# EAGLE design Sequencer-Logic-Prod-V2.1 copy (EAGLE 9.6.2)

## Sheet 1 of 9: uCode PC Counter
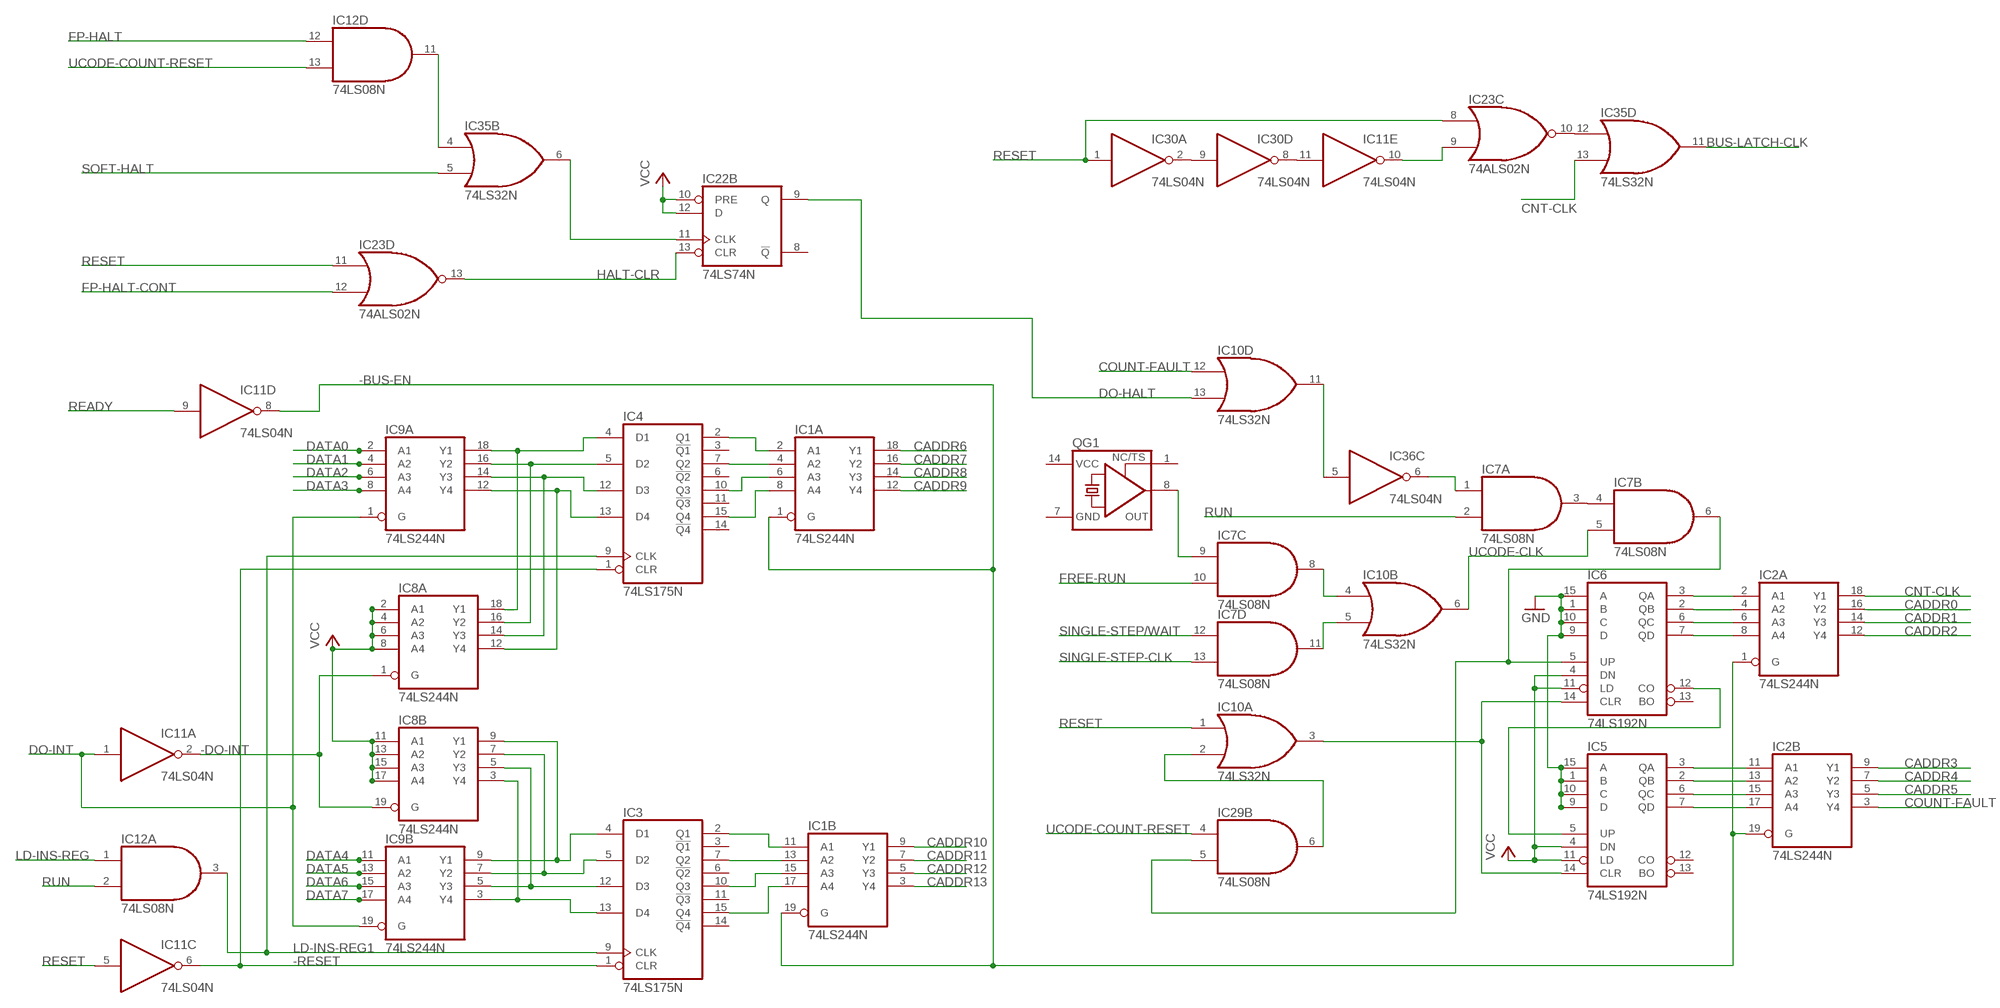
[diagram p0: schematic, sheet 1]

### Parts
IC1  74LS244N  [DIL20]
IC2  74LS244N  [DIL20]
IC3  74LS175N  [DIL16]
IC4  74LS175N  [DIL16]
IC5  74LS192N  [DIL16]
IC6  74LS192N  [DIL16]
IC7  74LS08N  [DIL14]
IC8  74LS244N  [DIL20]
IC9  74LS244N  [DIL20]
IC10  74LS32N  [DIL14]
IC11  74LS04N  [DIL14]
IC12  74LS08N  [DIL14]
IC22  74LS74N  [DIL14]
IC23  74ALS02N  [DIL14]
IC29  74LS08N  [DIL14]
IC30  74LS04N  [DIL14]
IC35  74LS32N  [DIL14]
IC36  74LS04N  [DIL14]
QG1  XO-14  [DIL14S]

### Nets
-BUS-EN: IC1.1(A:G) IC1.19(B:G) IC2.1(A:G) IC2.19(B:G) IC11.8(D:O) ; also sheet 2,8
-DO-INT: IC8.1(A:G) IC8.19(B:G) IC11.2(A:O)
-RESET: IC3.1(CLR) IC4.1(CLR) IC11.6(C:O) ; also sheet 8
BUS-LATCH-CLK: IC35.11(D:O) ; also sheet 2
CADDR0: IC2.16(A:Y2) ; also sheet 9
CADDR1: IC2.14(A:Y3) ; also sheet 9
CADDR2: IC2.12(A:Y4) ; also sheet 9
CADDR3: IC2.9(B:Y1) ; also sheet 9
CADDR4: IC2.7(B:Y2) ; also sheet 9
CADDR5: IC2.5(B:Y3) ; also sheet 9
CADDR6: IC1.18(A:Y1) ; also sheet 9
CADDR7: IC1.16(A:Y2) ; also sheet 9
CADDR8: IC1.14(A:Y3) ; also sheet 9
CADDR9: IC1.12(A:Y4) ; also sheet 9
CADDR10: IC1.9(B:Y1) ; also sheet 9
CADDR11: IC1.7(B:Y2) ; also sheet 9
CADDR12: IC1.5(B:Y3) ; also sheet 9
CADDR13: IC1.3(B:Y4) ; also sheet 9
CNT-CLK: IC2.18(A:Y1) IC35.13(D:I1)
COUNT-FAULT: IC2.3(B:Y4) IC10.12(D:I0)
COUNT-RESET: IC5.14(CLR) IC6.14(CLR) IC10.3(A:O)
DATA0: IC9.2(A:A1) ; also sheet 4,6,8
DATA1: IC9.4(A:A2) ; also sheet 4,6,8
DATA2: IC9.6(A:A3) ; also sheet 4,6,8
DATA3: IC9.8(A:A4) ; also sheet 4,6,8
DATA4: IC9.11(B:A1) ; also sheet 4,6,8
DATA5: IC9.13(B:A2) ; also sheet 4,6,8
DATA6: IC9.15(B:A3) ; also sheet 4,6,8
DATA7: IC9.17(B:A4) ; also sheet 4,6,8
DO-HALT: IC10.13(D:I1) IC22.9(B:Q)
DO-INT: IC9.1(A:G) IC9.19(B:G) IC11.1(A:I) ; also sheet 3
FP-HALT: IC12.12(D:I0) ; also sheet 5
FP-HALT-CONT: IC23.12(D:I1) ; also sheet 5
FREE-RUN: IC7.10(C:I1) ; also sheet 5
GND: IC5.1(B) IC5.9(D) IC5.10(C) IC5.15(A) IC6.1(B) IC6.9(D) IC6.10(C) IC6.15(A) ; also sheet 3,5,6,7,8,9
HALT-CLR: IC22.13(B:CLR) IC23.13(D:O)
LD-INS-REG: IC12.1(A:I0) ; also sheet 2
LD-INS-REG1: IC3.9(CLK) IC4.9(CLK) IC12.3(A:O)
N$1: IC5.5(UP) IC6.12(CO)
N$2: IC1.2(A:A1) IC4.2(Q1)
N$3: IC1.4(A:A2) IC4.7(Q2)
N$4: IC6.5(UP) IC7.6(B:O) IC29.5(B:I1)
N$5: IC4.4(D1) IC8.18(A:Y1) IC9.18(A:Y1)
N$6: IC4.5(D2) IC8.16(A:Y2) IC9.16(A:Y2)
N$7: IC2.2(A:A1) IC6.3(QA)
N$8: IC2.4(A:A2) IC6.2(QB)
N$9: IC2.6(A:A3) IC6.6(QC)
N$10: IC1.6(A:A3) IC4.10(Q3)
N$11: IC2.8(A:A4) IC6.7(QD)
N$12: IC2.11(B:A1) IC5.3(QA)
N$13: IC2.13(B:A2) IC5.2(QB)
N$14: IC2.15(B:A3) IC5.6(QC)
N$15: IC2.17(B:A4) IC5.7(QD)
N$16: IC7.1(A:I0) IC36.6(C:O)
N$17: IC4.12(D3) IC8.14(A:Y3) IC9.14(A:Y3)
N$18: IC4.13(D4) IC8.12(A:Y4) IC9.12(A:Y4)
N$19: IC3.4(D1) IC8.9(B:Y1) IC9.9(B:Y1)
N$20: IC3.5(D2) IC8.7(B:Y2) IC9.7(B:Y2)
N$21: IC3.12(D3) IC8.5(B:Y3) IC9.5(B:Y3)
N$22: IC3.13(D4) IC8.3(B:Y4) IC9.3(B:Y4)
N$23: IC1.8(A:A4) IC4.15(Q4)
N$26: IC10.11(D:O) IC36.5(C:I)
N$31: IC7.3(A:O) IC7.4(B:I0)
N$32: IC23.10(C:O) IC35.12(D:I0)
N$33: IC22.11(B:CLK) IC35.6(B:O)
N$34: IC1.11(B:A1) IC3.2(Q1)
N$35: IC1.13(B:A2) IC3.7(Q2)
N$36: IC1.15(B:A3) IC3.10(Q3)
N$37: IC1.17(B:A4) IC3.15(Q4)
N$38: IC7.11(D:O) IC10.5(B:I1)
N$39: IC7.8(C:O) IC10.4(B:I0)
N$40: IC7.9(C:I0) QG1.8(OUT)
N$42: IC11.11(E:I) IC30.8(D:O)
N$44: IC30.2(A:O) IC30.9(D:I)
N$46: IC11.10(E:O) IC23.9(C:I1)
N$54: IC12.11(D:O) IC35.4(B:I0)
N$55: IC10.2(A:I1) IC29.6(B:O)
READY: IC11.9(D:I) ; also sheet 9
RESET: IC10.1(A:I0) IC11.5(C:I) IC23.8(C:I0) IC23.11(D:I0) IC30.1(A:I) ; also sheet 3,5
RUN: IC7.2(A:I1) IC12.2(A:I1) ; also sheet 5
SINGLE-STEP-CLK: IC7.13(D:I1) ; also sheet 5
SINGLE-STEP/WAIT: IC7.12(D:I0) ; also sheet 5
SOFT-HALT: IC35.5(B:I1) ; also sheet 2
UCODE-CLK: IC7.5(B:I1) IC10.6(B:O)
UCODE-COUNT-RESET: IC12.13(D:I1) IC29.4(B:I0) ; also sheet 2
VCC: IC5.4(DN) IC5.11(LD) IC6.4(DN) IC6.11(LD) IC8.2(A:A1) IC8.4(A:A2) IC8.6(A:A3) IC8.8(A:A4) IC8.11(B:A1) IC8.13(B:A2) IC8.15(B:A3) IC8.17(B:A4) IC22.10(B:PRE) IC22.12(B:D) ; also sheet 3,5,7,9
Unconnected: IC3.3(!Q1) IC3.6(!Q2) IC3.11(!Q3) IC3.14(!Q4) IC4.3(!Q1) IC4.6(!Q2) IC4.11(!Q3) IC4.14(!Q4) IC5.12(CO) IC5.13(BO) IC6.13(BO) IC22.8(B:!Q) QG1.1(TS)

## Sheet 2 of 9: Latching
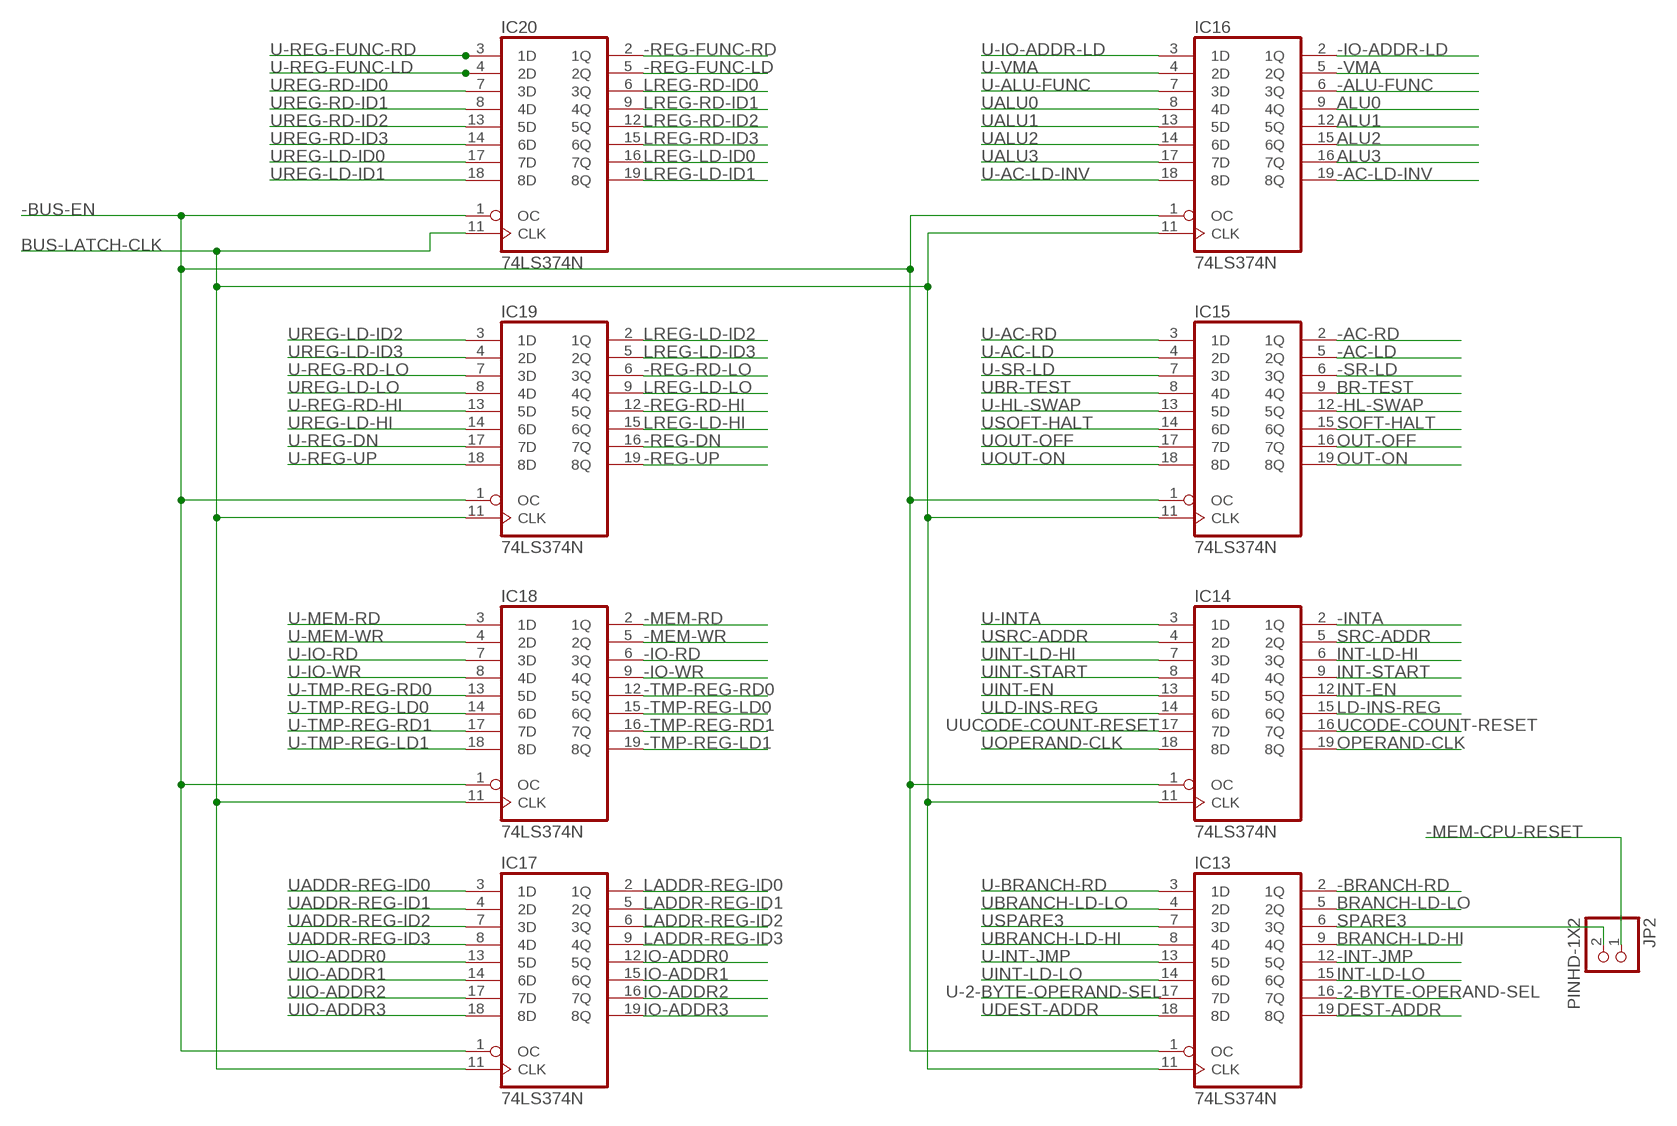
[diagram p1: schematic, sheet 2]

### Parts
IC13  74LS374N  [DIL20]
IC14  74LS374N  [DIL20]
IC15  74LS374N  [DIL20]
IC16  74LS374N  [DIL20]
IC17  74LS374N  [DIL20]
IC18  74LS374N  [DIL20]
IC19  74LS374N  [DIL20]
IC20  74LS374N  [DIL20]
JP2  PINHD-1X2  [1X02]

### Nets
-2-BYTE-OPERAND-SEL: IC13.16(7Q) ; also sheet 6
-AC-LD: IC15.5(2Q) ; also sheet 8
-AC-LD-INV: IC16.19(8Q) ; also sheet 8
-AC-RD: IC15.2(1Q) ; also sheet 8
-ALU-FUNC: IC16.6(3Q) ; also sheet 8
-BRANCH-RD: IC13.2(1Q) ; also sheet 4
-BUS-EN: IC13.1(OC) IC14.1(OC) IC15.1(OC) IC16.1(OC) IC17.1(OC) IC18.1(OC) IC19.1(OC) IC20.1(OC) ; also sheet 1,8
-HL-SWAP: IC15.12(5Q) ; also sheet 8
-INT-JMP: IC13.12(5Q) ; also sheet 4
-INTA: IC14.2(1Q) ; also sheet 8
-IO-ADDR-LD: IC16.2(1Q) ; also sheet 8
-IO-RD: IC18.6(3Q) ; also sheet 8
-IO-WR: IC18.9(4Q) ; also sheet 8
-MEM-CPU-RESET: JP2.1 ; also sheet 9
-MEM-RD: IC18.2(1Q) ; also sheet 8
-MEM-WR: IC18.5(2Q) ; also sheet 8
-REG-DN: IC19.16(7Q) ; also sheet 8
-REG-FUNC-LD: IC20.5(2Q) ; also sheet 8
-REG-FUNC-RD: IC20.2(1Q) ; also sheet 8
-REG-RD-HI: IC19.12(5Q) ; also sheet 8
-REG-RD-LO: IC19.6(3Q) ; also sheet 8
-REG-UP: IC19.19(8Q) ; also sheet 8
-SR-LD: IC15.6(3Q) ; also sheet 8
-TMP-REG-LD0: IC18.15(6Q) ; also sheet 8
-TMP-REG-LD1: IC18.19(8Q) ; also sheet 8
-TMP-REG-RD0: IC18.12(5Q) ; also sheet 8
-TMP-REG-RD1: IC18.16(7Q) ; also sheet 8
-VMA: IC16.5(2Q) ; also sheet 8
ALU0: IC16.9(4Q) ; also sheet 8
ALU1: IC16.12(5Q) ; also sheet 8
ALU2: IC16.15(6Q) ; also sheet 8
ALU3: IC16.16(7Q) ; also sheet 8
BR-TEST: IC15.9(4Q) ; also sheet 4
BRANCH-LD-HI: IC13.9(4Q) ; also sheet 4
BRANCH-LD-LO: IC13.5(2Q) ; also sheet 4
BUS-LATCH-CLK: IC13.11(CLK) IC14.11(CLK) IC15.11(CLK) IC16.11(CLK) IC17.11(CLK) IC18.11(CLK) IC19.11(CLK) IC20.11(CLK) ; also sheet 1
DEST-ADDR: IC13.19(8Q) ; also sheet 6
INT-EN: IC14.12(5Q) ; also sheet 3
INT-LD-HI: IC14.6(3Q) ; also sheet 4
INT-LD-LO: IC13.15(6Q) ; also sheet 4
INT-START: IC14.9(4Q) ; also sheet 3
IO-ADDR0: IC17.12(5Q) ; also sheet 8
IO-ADDR1: IC17.15(6Q) ; also sheet 8
IO-ADDR2: IC17.16(7Q) ; also sheet 8
IO-ADDR3: IC17.19(8Q) ; also sheet 8
LADDR-REG-ID0: IC17.2(1Q) ; also sheet 6
LADDR-REG-ID1: IC17.5(2Q) ; also sheet 6
LADDR-REG-ID2: IC17.6(3Q) ; also sheet 6
LADDR-REG-ID3: IC17.9(4Q) ; also sheet 6
LD-INS-REG: IC14.15(6Q) ; also sheet 1
LREG-LD-HI: IC19.15(6Q) ; also sheet 4
LREG-LD-ID0: IC20.16(7Q) ; also sheet 6
LREG-LD-ID1: IC20.19(8Q) ; also sheet 6
LREG-LD-ID2: IC19.2(1Q) ; also sheet 6
LREG-LD-ID3: IC19.5(2Q) ; also sheet 6
LREG-LD-LO: IC19.9(4Q) ; also sheet 4
LREG-RD-ID0: IC20.6(3Q) ; also sheet 6
LREG-RD-ID1: IC20.9(4Q) ; also sheet 6
LREG-RD-ID2: IC20.12(5Q) ; also sheet 6
LREG-RD-ID3: IC20.15(6Q) ; also sheet 6
OPERAND-CLK: IC14.19(8Q) ; also sheet 6
OUT-OFF: IC15.16(7Q) ; also sheet 3
OUT-ON: IC15.19(8Q) ; also sheet 3
SOFT-HALT: IC15.15(6Q) ; also sheet 1
SPARE3: IC13.6(3Q) JP2.2
SRC-ADDR: IC14.5(2Q) ; also sheet 6
U-2-BYTE-OPERAND-SEL: IC13.17(7D) ; also sheet 9
U-AC-LD: IC15.4(2D) ; also sheet 9
U-AC-LD-INV: IC16.18(8D) ; also sheet 9
U-AC-RD: IC15.3(1D) ; also sheet 9
U-ALU-FUNC: IC16.7(3D) ; also sheet 9
U-BRANCH-RD: IC13.3(1D) ; also sheet 9
U-HL-SWAP: IC15.13(5D) ; also sheet 9
U-INT-JMP: IC13.13(5D) ; also sheet 9
U-INTA: IC14.3(1D) ; also sheet 9
U-IO-ADDR-LD: IC16.3(1D) ; also sheet 9
U-IO-RD: IC18.7(3D) ; also sheet 9
U-IO-WR: IC18.8(4D) ; also sheet 9
U-MEM-RD: IC18.3(1D) ; also sheet 9
U-MEM-WR: IC18.4(2D) ; also sheet 9
U-REG-DN: IC19.17(7D) ; also sheet 9
U-REG-FUNC-LD: IC20.4(2D) ; also sheet 9
U-REG-FUNC-RD: IC20.3(1D) ; also sheet 9
U-REG-RD-HI: IC19.13(5D) ; also sheet 9
U-REG-RD-LO: IC19.7(3D) ; also sheet 9
U-REG-UP: IC19.18(8D) ; also sheet 9
U-SR-LD: IC15.7(3D) ; also sheet 9
U-TMP-REG-LD0: IC18.14(6D) ; also sheet 9
U-TMP-REG-LD1: IC18.18(8D) ; also sheet 9
U-TMP-REG-RD0: IC18.13(5D) ; also sheet 9
U-TMP-REG-RD1: IC18.17(7D) ; also sheet 9
U-VMA: IC16.4(2D) ; also sheet 9
UADDR-REG-ID0: IC17.3(1D) ; also sheet 9
UADDR-REG-ID1: IC17.4(2D) ; also sheet 9
UADDR-REG-ID2: IC17.7(3D) ; also sheet 9
UADDR-REG-ID3: IC17.8(4D) ; also sheet 9
UALU0: IC16.8(4D) ; also sheet 9
UALU1: IC16.13(5D) ; also sheet 9
UALU2: IC16.14(6D) ; also sheet 9
UALU3: IC16.17(7D) ; also sheet 9
UBR-TEST: IC15.8(4D) ; also sheet 9
UBRANCH-LD-HI: IC13.8(4D) ; also sheet 9
UBRANCH-LD-LO: IC13.4(2D) ; also sheet 9
UCODE-COUNT-RESET: IC14.16(7Q) ; also sheet 1
UDEST-ADDR: IC13.18(8D) ; also sheet 9
UINT-EN: IC14.13(5D) ; also sheet 9
UINT-LD-HI: IC14.7(3D) ; also sheet 9
UINT-LD-LO: IC13.14(6D) ; also sheet 9
UINT-START: IC14.8(4D) ; also sheet 9
UIO-ADDR0: IC17.13(5D) ; also sheet 9
UIO-ADDR1: IC17.14(6D) ; also sheet 9
UIO-ADDR2: IC17.17(7D) ; also sheet 9
UIO-ADDR3: IC17.18(8D) ; also sheet 9
ULD-INS-REG: IC14.14(6D) ; also sheet 9
UOPERAND-CLK: IC14.18(8D) ; also sheet 9
UOUT-OFF: IC15.17(7D) ; also sheet 9
UOUT-ON: IC15.18(8D) ; also sheet 9
UREG-LD-HI: IC19.14(6D) ; also sheet 9
UREG-LD-ID0: IC20.17(7D) ; also sheet 9
UREG-LD-ID1: IC20.18(8D) ; also sheet 9
UREG-LD-ID2: IC19.3(1D) ; also sheet 9
UREG-LD-ID3: IC19.4(2D) ; also sheet 9
UREG-LD-LO: IC19.8(4D) ; also sheet 9
UREG-RD-ID0: IC20.7(3D) ; also sheet 9
UREG-RD-ID1: IC20.8(4D) ; also sheet 9
UREG-RD-ID2: IC20.13(5D) ; also sheet 9
UREG-RD-ID3: IC20.14(6D) ; also sheet 9
USOFT-HALT: IC15.14(6D) ; also sheet 9
USPARE3: IC13.7(3D) ; also sheet 9
USRC-ADDR: IC14.4(2D) ; also sheet 9
UUCODE-COUNT-RESET: IC14.17(7D) ; also sheet 9

## Sheet 3 of 9: Interrupt Mgmt
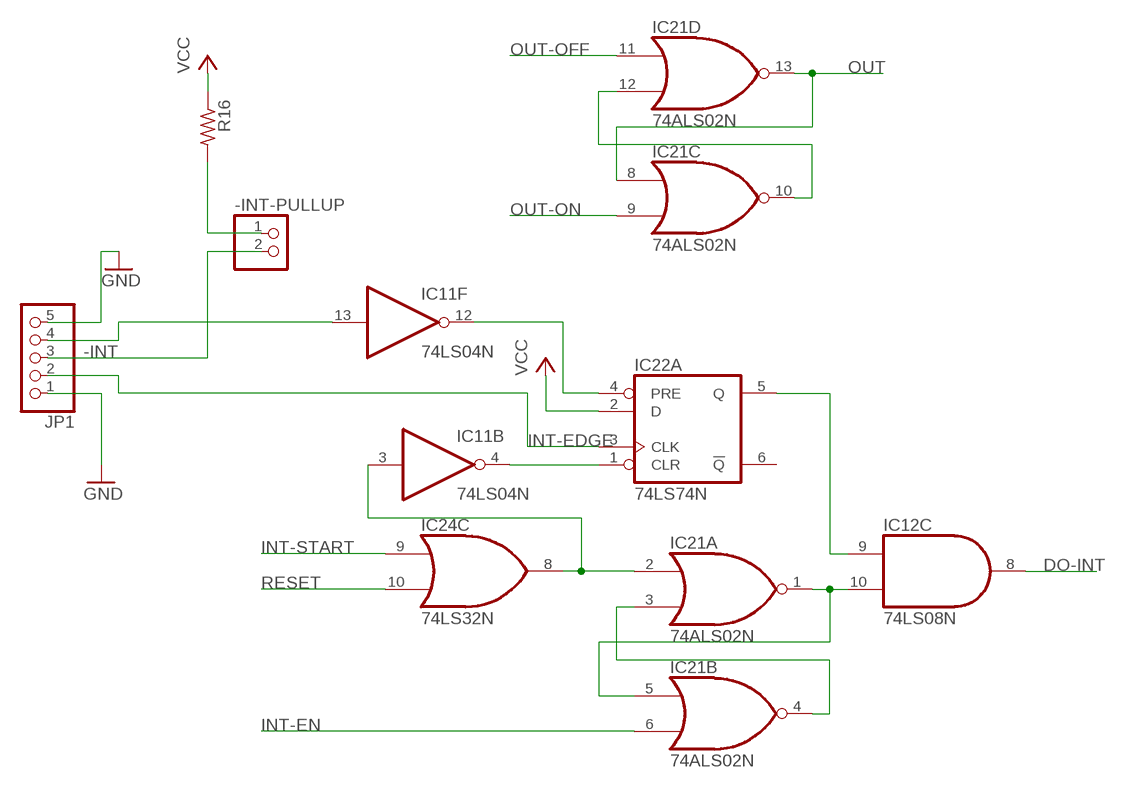
[diagram p2: schematic, sheet 3]

### Parts
-INT-PULLUP  PINHD-1X2  [1X02]
IC21  74ALS02N  [DIL14]
IC24  74LS32N  [DIL14]
JP1  PINHD-1X5  [1X05]
R16  10k  R-US_0207/10  [0207/10]

### Nets
-INT: -INT-PULLUP.2 JP1.3 ; also sheet 8
DO-INT: IC12.8(C:O) ; also sheet 1
GND: JP1.1 JP1.5 ; also sheet 1,5,6,7,8,9
INT-EDGE: IC22.3(A:CLK) JP1.2
INT-EN: IC21.6(B:I1) ; also sheet 2
INT-START: IC24.9(C:I0) ; also sheet 2
N$24: IC12.10(C:I1) IC21.1(A:O) IC21.5(B:I0)
N$25: IC21.3(A:I1) IC21.4(B:O)
N$27: IC11.3(B:I) IC21.2(A:I0) IC24.8(C:O)
N$28: IC12.9(C:I0) IC22.5(A:Q)
N$29: IC11.4(B:O) IC22.1(A:CLR)
N$41: IC11.12(F:O) IC22.4(A:PRE)
N$43: IC11.13(F:I) JP1.4
N$48: IC21.10(C:O) IC21.12(D:I1)
N$49: -INT-PULLUP.1 R16.2
OUT: IC21.8(C:I0) IC21.13(D:O) ; also sheet 5,8
OUT-OFF: IC21.11(D:I0) ; also sheet 2
OUT-ON: IC21.9(C:I1) ; also sheet 2
RESET: IC24.10(C:I1) ; also sheet 1,5
VCC: IC22.2(A:D) R16.1 ; also sheet 1,5,7,9
Unconnected: IC22.6(A:!Q)

## Sheet 4 of 9: Branch Mgmt
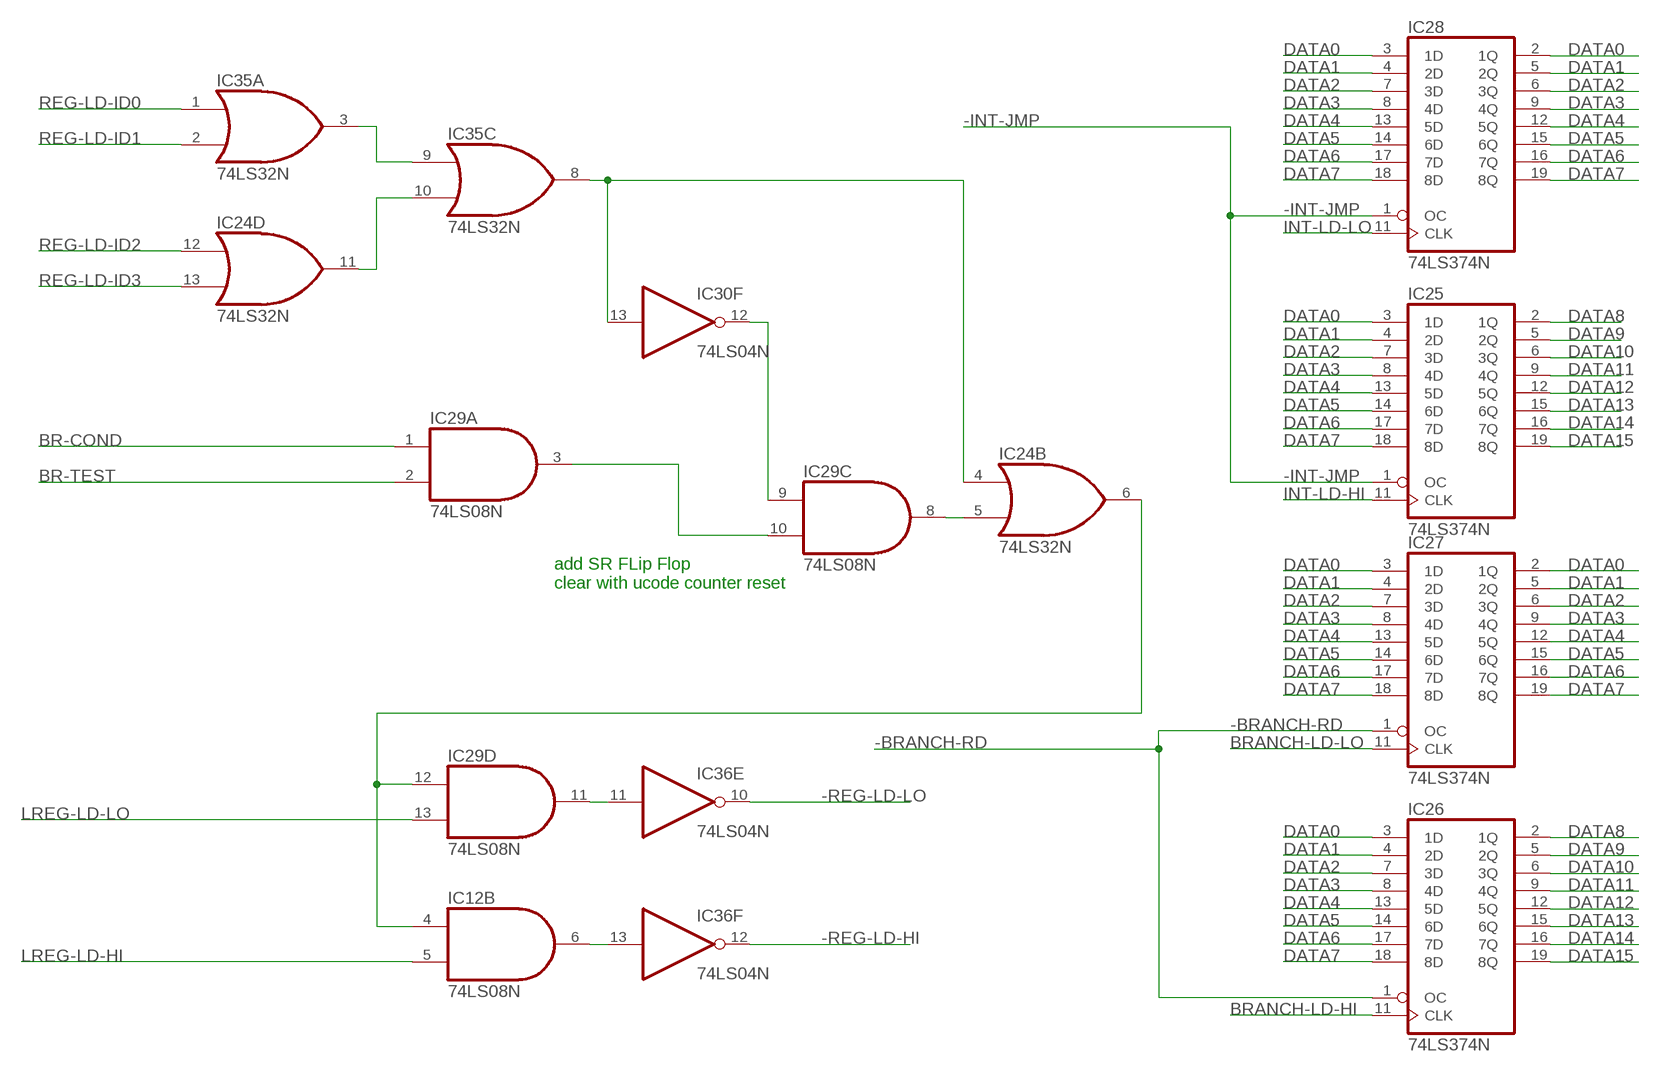
[diagram p3: schematic, sheet 4]

### Parts
IC25  74LS374N  [DIL20]
IC26  74LS374N  [DIL20]
IC27  74LS374N  [DIL20]
IC28  74LS374N  [DIL20]

### Nets
-BRANCH-RD: IC26.1(OC) IC27.1(OC) ; also sheet 2
-INT-JMP: IC25.1(OC) IC28.1(OC) ; also sheet 2
-REG-LD-HI: IC36.12(F:O) ; also sheet 8
-REG-LD-LO: IC36.10(E:O) ; also sheet 8
BR-COND: IC29.1(A:I0) ; also sheet 8
BR-TEST: IC29.2(A:I1) ; also sheet 2
BRANCH-LD-HI: IC26.11(CLK) ; also sheet 2
BRANCH-LD-LO: IC27.11(CLK) ; also sheet 2
DATA0: IC25.3(1D) IC26.3(1D) IC27.2(1Q) IC27.3(1D) IC28.2(1Q) IC28.3(1D) ; also sheet 1,6,8
DATA1: IC25.4(2D) IC26.4(2D) IC27.4(2D) IC27.5(2Q) IC28.4(2D) IC28.5(2Q) ; also sheet 1,6,8
DATA2: IC25.7(3D) IC26.7(3D) IC27.6(3Q) IC27.7(3D) IC28.6(3Q) IC28.7(3D) ; also sheet 1,6,8
DATA3: IC25.8(4D) IC26.8(4D) IC27.8(4D) IC27.9(4Q) IC28.8(4D) IC28.9(4Q) ; also sheet 1,6,8
DATA4: IC25.13(5D) IC26.13(5D) IC27.12(5Q) IC27.13(5D) IC28.12(5Q) IC28.13(5D) ; also sheet 1,6,8
DATA5: IC25.14(6D) IC26.14(6D) IC27.14(6D) IC27.15(6Q) IC28.14(6D) IC28.15(6Q) ; also sheet 1,6,8
DATA6: IC25.17(7D) IC26.17(7D) IC27.16(7Q) IC27.17(7D) IC28.16(7Q) IC28.17(7D) ; also sheet 1,6,8
DATA7: IC25.18(8D) IC26.18(8D) IC27.18(8D) IC27.19(8Q) IC28.18(8D) IC28.19(8Q) ; also sheet 1,6,8
DATA8: IC25.2(1Q) IC26.2(1Q) ; also sheet 8
DATA9: IC25.5(2Q) IC26.5(2Q) ; also sheet 8
DATA10: IC25.6(3Q) IC26.6(3Q) ; also sheet 8
DATA11: IC25.9(4Q) IC26.9(4Q) ; also sheet 8
DATA12: IC25.12(5Q) IC26.12(5Q) ; also sheet 8
DATA13: IC25.15(6Q) IC26.15(6Q) ; also sheet 8
DATA14: IC25.16(7Q) IC26.16(7Q) ; also sheet 8
DATA15: IC25.19(8Q) IC26.19(8Q) ; also sheet 8
INT-LD-HI: IC25.11(CLK) ; also sheet 2
INT-LD-LO: IC28.11(CLK) ; also sheet 2
LREG-LD-HI: IC12.5(B:I1) ; also sheet 2
LREG-LD-LO: IC29.13(D:I1) ; also sheet 2
N$45: IC35.3(A:O) IC35.9(C:I0)
N$47: IC24.11(D:O) IC35.10(C:I1)
N$50: IC29.3(A:O) IC29.10(C:I1)
N$51: IC29.9(C:I0) IC30.12(F:O)
N$52: IC24.5(B:I1) IC29.8(C:O)
N$53: IC12.4(B:I0) IC24.6(B:O) IC29.12(D:I0)
N$56: IC24.4(B:I0) IC30.13(F:I) IC35.8(C:O)
N$57: IC29.11(D:O) IC36.11(E:I)
N$58: IC12.6(B:O) IC36.13(F:I)
REG-LD-ID0: IC35.1(A:I0) ; also sheet 6,8
REG-LD-ID1: IC35.2(A:I1) ; also sheet 6,8
REG-LD-ID2: IC24.12(D:I0) ; also sheet 6,8
REG-LD-ID3: IC24.13(D:I1) ; also sheet 6,8

### Notes on the sheet
- add SR FLip Flop
  clear with ucode counter reset

## Sheet 5 of 9: CONTROL INTERFACE
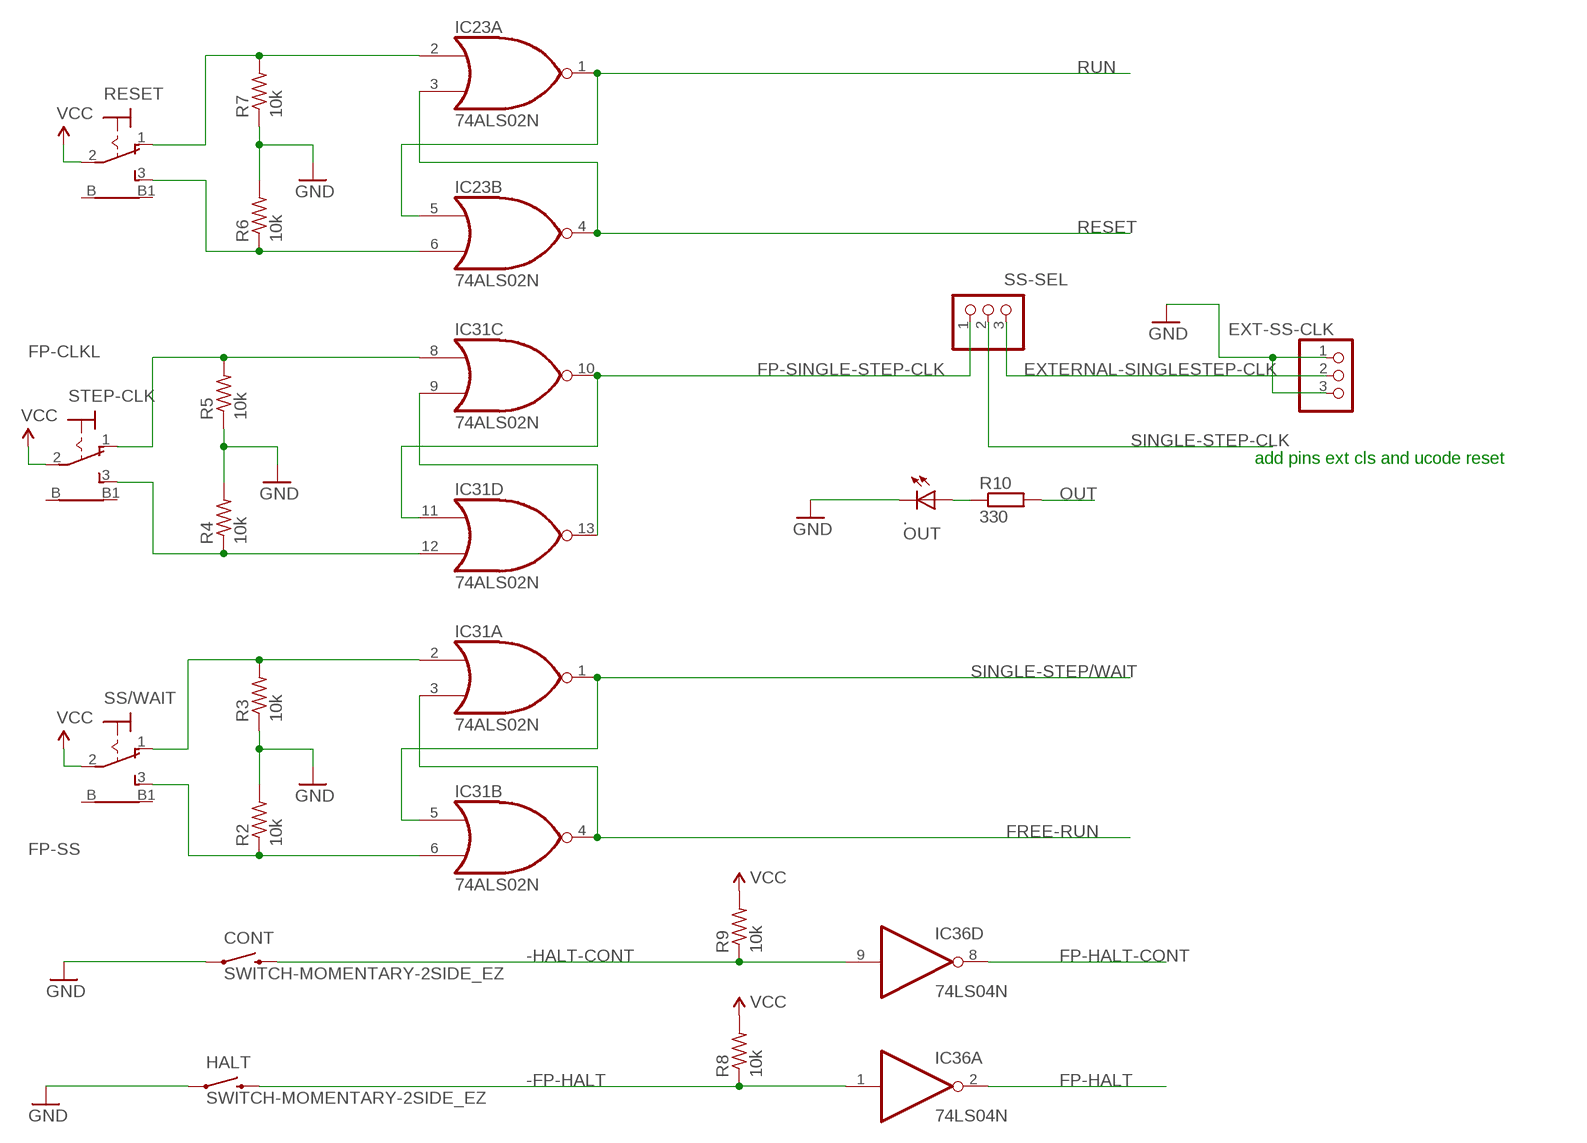
[diagram p4: schematic, sheet 5]

### Parts
.  OUT  LED5MM  [LED5MM]
CONT  SWITCH-MOMENTARY-2SIDE_EZ  [TACTILE-PTH-SIDEEZ]
EXT-SS-CLK  PINHD-1X3  [1X03]
HALT  SWITCH-MOMENTARY-2SIDE_EZ  [TACTILE-PTH-SIDEEZ]
IC31  74ALS02N  [DIL14]
R2  10k  R-US_0207/10  [0207/10]
R3  10k  R-US_0207/10  [0207/10]
R4  10k  R-US_0207/10  [0207/10]
R5  10k  R-US_0207/10  [0207/10]
R6  10k  R-US_0207/10  [0207/10]
R7  10k  R-US_0207/10  [0207/10]
R8  10k  R-US_0207/10  [0207/10]
R9  10k  R-US_0207/10  [0207/10]
R10  330  R0207/10  [0207/10]
RESET  9070-1W  [9070-1W]
SS-SEL  PINHD-1X3  [1X03]
SS/WAIT  9070-1W  [9070-1W]
STEP-CLK  9070-1W  [9070-1W]

### Nets
-FP-HALT: HALT.2 IC36.1(A:I) R8.1
-HALT-CONT: CONT.2 IC36.9(D:I) R9.1
EXTERNAL-SINGLESTEP-CLK: EXT-SS-CLK.2 SS-SEL.3
FP-CLKH: IC31.12(D:I1) R4.1 STEP-CLK.3(S)
FP-CLKL: IC31.8(C:I0) R5.2 STEP-CLK.1(O)
FP-EXECUTE: IC23.6(B:I1) R6.1 RESET.3(S)
FP-FREERUN: IC31.2(A:I0) R3.2 SS/WAIT.1(O)
FP-HALT: IC36.2(A:O) ; also sheet 1
FP-HALT-CONT: IC36.8(D:O) ; also sheet 1
FP-RESET: IC23.2(A:I0) R7.2 RESET.1(O)
FP-SINGLE-STEP-CLK: IC31.10(C:O) IC31.11(D:I0) SS-SEL.1
FP-SS: IC31.6(B:I1) R2.1 SS/WAIT.3(S)
FREE-RUN: IC31.3(A:I1) IC31.4(B:O) ; also sheet 1
GND: ..K(C) CONT.1 EXT-SS-CLK.1 EXT-SS-CLK.3 HALT.1 R2.2 R3.1 R4.2 R5.1 R6.2 R7.1 ; also sheet 1,3,6,7,8,9
HARD-RESET1: IC31.9(C:I1) IC31.13(D:O)
N$59: ..A R10.1
OUT: R10.2 ; also sheet 3,8
RESET: IC23.3(A:I1) IC23.4(B:O) ; also sheet 1,3
RUN: IC23.1(A:O) IC23.5(B:I0) ; also sheet 1
SINGLE-STEP-CLK: SS-SEL.2 ; also sheet 1
SINGLE-STEP/WAIT: IC31.1(A:O) IC31.5(B:I0) ; also sheet 1
VCC: R8.2 R9.2 RESET.2(P) SS/WAIT.2(P) STEP-CLK.2(P) ; also sheet 1,3,7,9
Unconnected: RESET.B RESET.B1 SS/WAIT.B SS/WAIT.B1 STEP-CLK.B STEP-CLK.B1

### Notes on the sheet
- add pins ext cls and ucode reset

## Sheet 6 of 9: OPERAND REGISTER MGMT
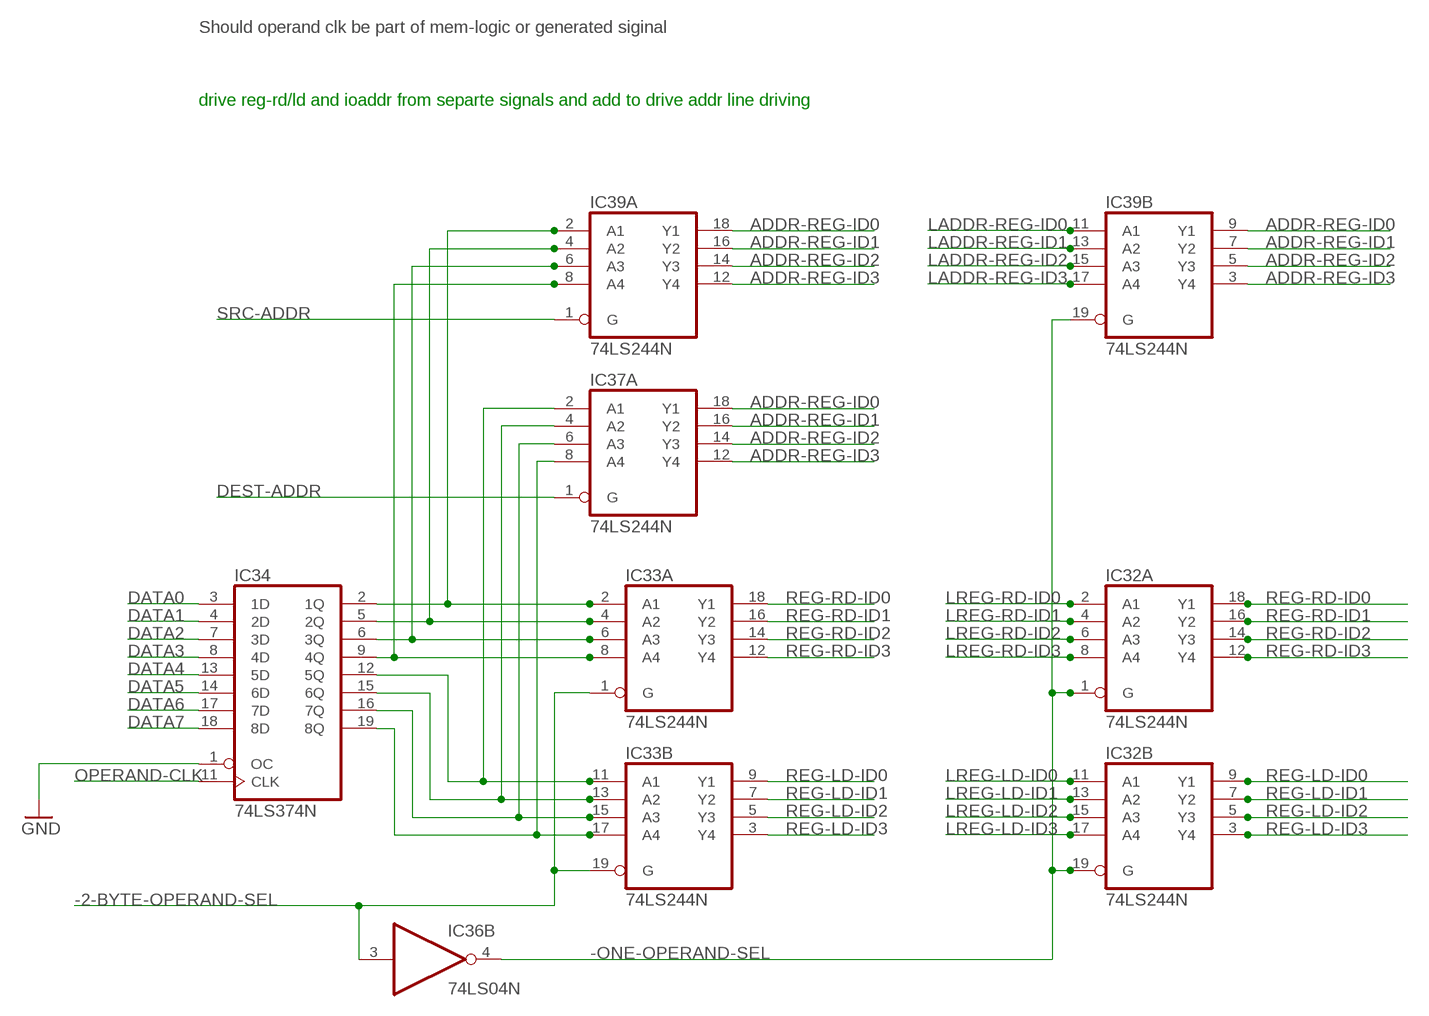
[diagram p5: schematic, sheet 6]

### Parts
IC32  74LS244N  [DIL20]
IC33  74LS244N  [DIL20]
IC34  74LS374N  [DIL20]
IC37  74LS244N  [DIL20]
IC39  74LS244N  [DIL20]

### Nets
-2-BYTE-OPERAND-SEL: IC33.1(A:G) IC33.19(B:G) IC36.3(B:I) ; also sheet 2
-ONE-OPERAND-SEL: IC32.1(A:G) IC32.19(B:G) IC36.4(B:O) IC39.19(B:G)
ADDR-REG-ID0: IC37.18(A:Y1) IC39.9(B:Y1) IC39.18(A:Y1) ; also sheet 8
ADDR-REG-ID1: IC37.16(A:Y2) IC39.7(B:Y2) IC39.16(A:Y2) ; also sheet 8
ADDR-REG-ID2: IC37.14(A:Y3) IC39.5(B:Y3) IC39.14(A:Y3) ; also sheet 8
ADDR-REG-ID3: IC37.12(A:Y4) IC39.3(B:Y4) IC39.12(A:Y4) ; also sheet 8
DATA0: IC34.3(1D) ; also sheet 1,4,8
DATA1: IC34.4(2D) ; also sheet 1,4,8
DATA2: IC34.7(3D) ; also sheet 1,4,8
DATA3: IC34.8(4D) ; also sheet 1,4,8
DATA4: IC34.13(5D) ; also sheet 1,4,8
DATA5: IC34.14(6D) ; also sheet 1,4,8
DATA6: IC34.17(7D) ; also sheet 1,4,8
DATA7: IC34.18(8D) ; also sheet 1,4,8
DEST-ADDR: IC37.1(A:G) ; also sheet 2
GND: IC34.1(OC) ; also sheet 1,3,5,7,8,9
LADDR-REG-ID0: IC39.11(B:A1) ; also sheet 2
LADDR-REG-ID1: IC39.13(B:A2) ; also sheet 2
LADDR-REG-ID2: IC39.15(B:A3) ; also sheet 2
LADDR-REG-ID3: IC39.17(B:A4) ; also sheet 2
LREG-LD-ID0: IC32.11(B:A1) ; also sheet 2
LREG-LD-ID1: IC32.13(B:A2) ; also sheet 2
LREG-LD-ID2: IC32.15(B:A3) ; also sheet 2
LREG-LD-ID3: IC32.17(B:A4) ; also sheet 2
LREG-RD-ID0: IC32.2(A:A1) ; also sheet 2
LREG-RD-ID1: IC32.4(A:A2) ; also sheet 2
LREG-RD-ID2: IC32.6(A:A3) ; also sheet 2
LREG-RD-ID3: IC32.8(A:A4) ; also sheet 2
N$61: IC33.17(B:A4) IC34.19(8Q) IC37.8(A:A4)
N$62: IC33.2(A:A1) IC34.2(1Q) IC39.2(A:A1)
N$63: IC33.4(A:A2) IC34.5(2Q) IC39.4(A:A2)
N$64: IC33.6(A:A3) IC34.6(3Q) IC39.6(A:A3)
N$65: IC33.8(A:A4) IC34.9(4Q) IC39.8(A:A4)
N$66: IC33.11(B:A1) IC34.12(5Q) IC37.2(A:A1)
N$68: IC33.13(B:A2) IC34.15(6Q) IC37.4(A:A2)
N$69: IC33.15(B:A3) IC34.16(7Q) IC37.6(A:A3)
OPERAND-CLK: IC34.11(CLK) ; also sheet 2
REG-LD-ID0: IC32.9(B:Y1) IC33.9(B:Y1) ; also sheet 4,8
REG-LD-ID1: IC32.7(B:Y2) IC33.7(B:Y2) ; also sheet 4,8
REG-LD-ID2: IC32.5(B:Y3) IC33.5(B:Y3) ; also sheet 4,8
REG-LD-ID3: IC32.3(B:Y4) IC33.3(B:Y4) ; also sheet 4,8
REG-RD-ID0: IC32.18(A:Y1) IC33.18(A:Y1) ; also sheet 8
REG-RD-ID1: IC32.16(A:Y2) IC33.16(A:Y2) ; also sheet 8
REG-RD-ID2: IC32.14(A:Y3) IC33.14(A:Y3) ; also sheet 8
REG-RD-ID3: IC32.12(A:Y4) IC33.12(A:Y4) ; also sheet 8
SRC-ADDR: IC39.1(A:G) ; also sheet 2

### Notes on the sheet
- Should operand clk be part of mem-logic or generated siginal
- drive reg-rd/ld and ioaddr from separte signals and add to drive addr line driving

## Sheet 7 of 9: BYPASS and UNUSED
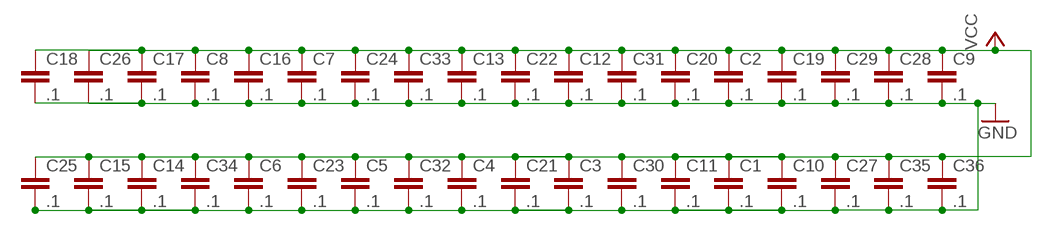
[diagram p6: schematic, sheet 7]

### Parts
C1  .1  CAPEZ  [CAP-PTH-SMALLEZ]
C2  .1  CAPEZ  [CAP-PTH-SMALLEZ]
C3  .1  CAPEZ  [CAP-PTH-SMALLEZ]
C4  .1  CAPEZ  [CAP-PTH-SMALLEZ]
C5  .1  CAPEZ  [CAP-PTH-SMALLEZ]
C6  .1  CAPEZ  [CAP-PTH-SMALLEZ]
C7  .1  CAPEZ  [CAP-PTH-SMALLEZ]
C8  .1  CAPEZ  [CAP-PTH-SMALLEZ]
C9  .1  CAPEZ  [CAP-PTH-SMALLEZ]
C10  .1  CAPEZ  [CAP-PTH-SMALLEZ]
C11  .1  CAPEZ  [CAP-PTH-SMALLEZ]
C12  .1  CAPEZ  [CAP-PTH-SMALLEZ]
C13  .1  CAPEZ  [CAP-PTH-SMALLEZ]
C14  .1  CAPEZ  [CAP-PTH-SMALLEZ]
C15  .1  CAPEZ  [CAP-PTH-SMALLEZ]
C16  .1  CAPEZ  [CAP-PTH-SMALLEZ]
C17  .1  CAPEZ  [CAP-PTH-SMALLEZ]
C18  .1  CAPEZ  [CAP-PTH-SMALLEZ]
C19  .1  CAPEZ  [CAP-PTH-SMALLEZ]
C20  .1  CAPEZ  [CAP-PTH-SMALLEZ]
C21  .1  CAPEZ  [CAP-PTH-SMALLEZ]
C22  .1  CAPEZ  [CAP-PTH-SMALLEZ]
C23  .1  CAPEZ  [CAP-PTH-SMALLEZ]
C24  .1  CAPEZ  [CAP-PTH-SMALLEZ]
C25  .1  CAPEZ  [CAP-PTH-SMALLEZ]
C26  .1  CAPEZ  [CAP-PTH-SMALLEZ]
C27  .1  CAPEZ  [CAP-PTH-SMALLEZ]
C28  .1  CAPEZ  [CAP-PTH-SMALLEZ]
C29  .1  CAPEZ  [CAP-PTH-SMALLEZ]
C30  .1  CAPEZ  [CAP-PTH-SMALLEZ]
C31  .1  CAPEZ  [CAP-PTH-SMALLEZ]
C32  .1  CAPEZ  [CAP-PTH-SMALLEZ]
C33  .1  CAPEZ  [CAP-PTH-SMALLEZ]
C34  .1  CAPEZ  [CAP-PTH-SMALLEZ]
C35  .1  CAPEZ  [CAP-PTH-SMALLEZ]
C36  .1  CAPEZ  [CAP-PTH-SMALLEZ]

### Nets
GND: C1.2 C2.2 C3.2 C4.2 C5.2 C6.2 C7.2 C8.2 C9.2 C10.2 C11.2 C12.2 C13.2 C14.2 C15.2 C16.2 C17.2 C18.2 C19.2 C20.2 C21.2 C22.2 C23.2 C24.2 C25.2 C26.2 C27.2 C28.2 C29.2 C30.2 C31.2 C32.2 C33.2 C34.2 C35.2 C36.2 ; also sheet 1,3,5,6,8,9
VCC: C1.1 C2.1 C3.1 C4.1 C5.1 C6.1 C7.1 C8.1 C9.1 C10.1 C11.1 C12.1 C13.1 C14.1 C15.1 C16.1 C17.1 C18.1 C19.1 C20.1 C21.1 C22.1 C23.1 C24.1 C25.1 C26.1 C27.1 C28.1 C29.1 C30.1 C31.1 C32.1 C33.1 C34.1 C35.1 C36.1 ; also sheet 1,3,5,9

## Sheet 8 of 9: BUS
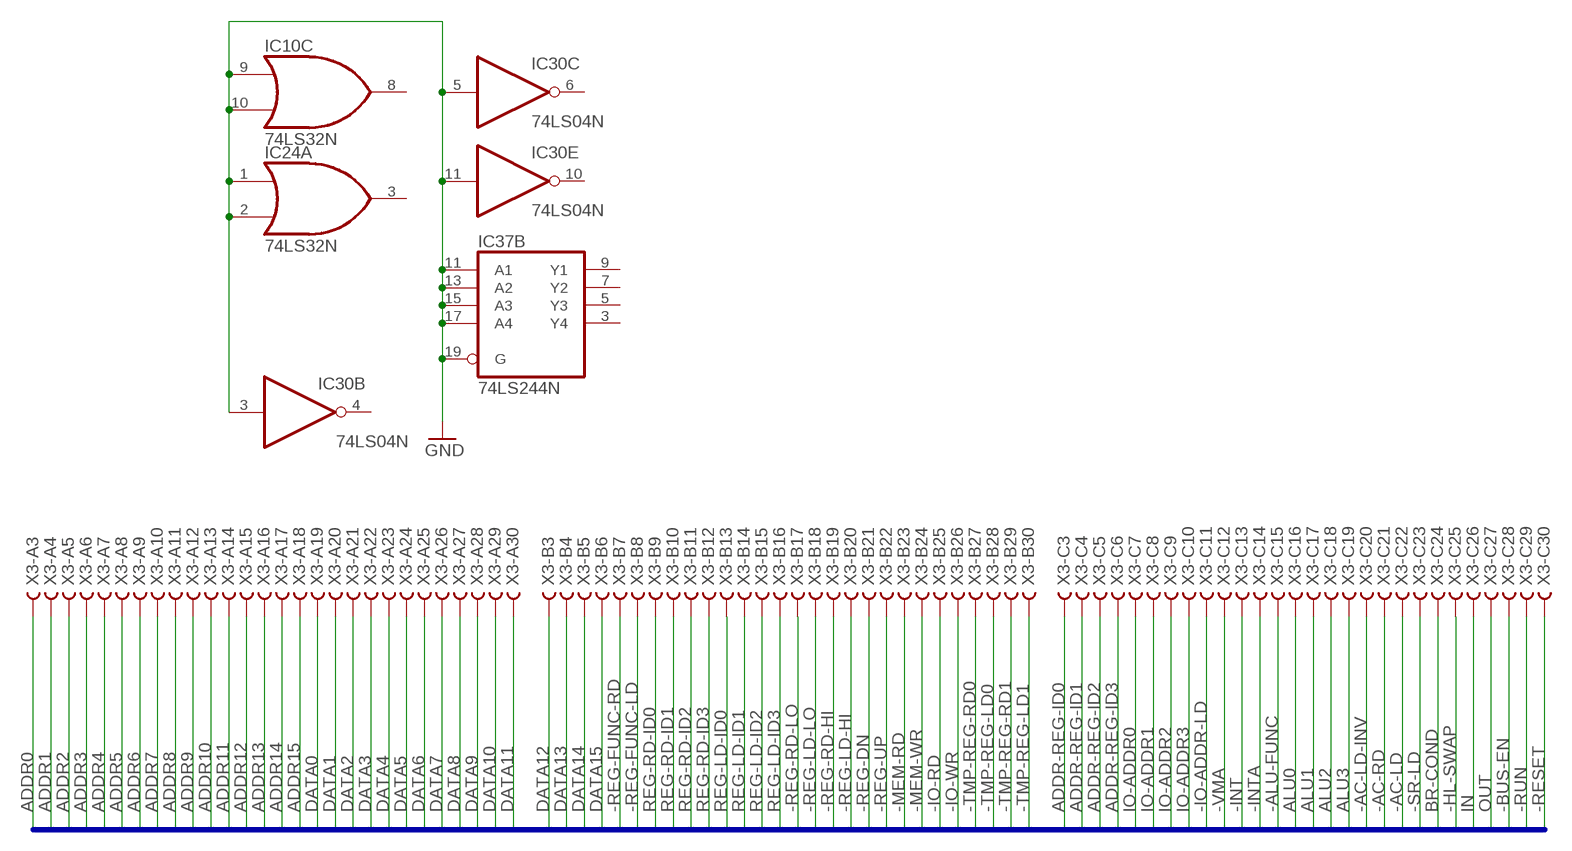
[diagram p7: schematic, sheet 8]

### Parts
X3  FABC96R  [FABC96R]

### Nets
-AC-LD: X3.C22 ; also sheet 2
-AC-LD-INV: X3.C20 ; also sheet 2
-AC-RD: X3.C21 ; also sheet 2
-ALU-FUNC: X3.C15 ; also sheet 2
-BUS-EN: X3.C28 ; also sheet 1,2
-HL-SWAP: X3.C25 ; also sheet 2
-INT: X3.C13 ; also sheet 3
-INTA: X3.C14 ; also sheet 2
-IO-ADDR-LD: X3.C11 ; also sheet 2
-IO-RD: X3.B25 ; also sheet 2
-IO-WR: X3.B26 ; also sheet 2
-MEM-RD: X3.B23 ; also sheet 2
-MEM-WR: X3.B24 ; also sheet 2
-REG-DN: X3.B21 ; also sheet 2
-REG-FUNC-LD: X3.B8 ; also sheet 2
-REG-FUNC-RD: X3.B7 ; also sheet 2
-REG-LD-HI: X3.B20 ; also sheet 4
-REG-LD-LO: X3.B18 ; also sheet 4
-REG-RD-HI: X3.B19 ; also sheet 2
-REG-RD-LO: X3.B17 ; also sheet 2
-REG-UP: X3.B22 ; also sheet 2
-RESET: X3.C30 ; also sheet 1
-RUN: X3.C29
-SR-LD: X3.C23 ; also sheet 2
-TMP-REG-LD0: X3.B28 ; also sheet 2
-TMP-REG-LD1: X3.B30 ; also sheet 2
-TMP-REG-RD0: X3.B27 ; also sheet 2
-TMP-REG-RD1: X3.B29 ; also sheet 2
-VMA: X3.C12 ; also sheet 2
ADDR0: X3.A3
ADDR1: X3.A4
ADDR2: X3.A5
ADDR3: X3.A6
ADDR4: X3.A7
ADDR5: X3.A8
ADDR6: X3.A9
ADDR7: X3.A10
ADDR8: X3.A11
ADDR9: X3.A12
ADDR10: X3.A13
ADDR11: X3.A14
ADDR12: X3.A15
ADDR13: X3.A16
ADDR14: X3.A17
ADDR15: X3.A18
ADDR-REG-ID0: X3.C3 ; also sheet 6
ADDR-REG-ID1: X3.C4 ; also sheet 6
ADDR-REG-ID2: X3.C5 ; also sheet 6
ADDR-REG-ID3: X3.C6 ; also sheet 6
ALU0: X3.C16 ; also sheet 2
ALU1: X3.C17 ; also sheet 2
ALU2: X3.C18 ; also sheet 2
ALU3: X3.C19 ; also sheet 2
BR-COND: X3.C24 ; also sheet 4
DATA0: X3.A19 ; also sheet 1,4,6
DATA1: X3.A20 ; also sheet 1,4,6
DATA2: X3.A21 ; also sheet 1,4,6
DATA3: X3.A22 ; also sheet 1,4,6
DATA4: X3.A23 ; also sheet 1,4,6
DATA5: X3.A24 ; also sheet 1,4,6
DATA6: X3.A25 ; also sheet 1,4,6
DATA7: X3.A26 ; also sheet 1,4,6
DATA8: X3.A27 ; also sheet 4
DATA9: X3.A28 ; also sheet 4
DATA10: X3.A29 ; also sheet 4
DATA11: X3.A30 ; also sheet 4
DATA12: X3.B3 ; also sheet 4
DATA13: X3.B4 ; also sheet 4
DATA14: X3.B5 ; also sheet 4
DATA15: X3.B6 ; also sheet 4
GND: IC10.9(C:I0) IC10.10(C:I1) IC24.1(A:I0) IC24.2(A:I1) IC30.3(B:I) IC30.5(C:I) IC30.11(E:I) IC37.11(B:A1) IC37.13(B:A2) IC37.15(B:A3) IC37.17(B:A4) IC37.19(B:G) ; also sheet 1,3,5,6,7,9
IN: X3.C26
IO-ADDR0: X3.C7 ; also sheet 2
IO-ADDR1: X3.C8 ; also sheet 2
IO-ADDR2: X3.C9 ; also sheet 2
IO-ADDR3: X3.C10 ; also sheet 2
OUT: X3.C27 ; also sheet 3,5
REG-LD-ID0: X3.B13 ; also sheet 4,6
REG-LD-ID1: X3.B14 ; also sheet 4,6
REG-LD-ID2: X3.B15 ; also sheet 4,6
REG-LD-ID3: X3.B16 ; also sheet 4,6
REG-RD-ID0: X3.B9 ; also sheet 6
REG-RD-ID1: X3.B10 ; also sheet 6
REG-RD-ID2: X3.B11 ; also sheet 6
REG-RD-ID3: X3.B12 ; also sheet 6
Unconnected: IC10.8(C:O) IC24.3(A:O) IC30.4(B:O) IC30.6(C:O) IC30.10(E:O) IC37.3(B:Y4) IC37.5(B:Y3) IC37.7(B:Y2) IC37.9(B:Y1) X3.A1 X3.A2 X3.A31 X3.A32 X3.B1 X3.B2 X3.B31 X3.B32 X3.C1 X3.C2 X3.C31 X3.C32

### Buses
MAINBUS:-AC-LD,-AC-LD-INV,-AC-RD,ADDR[0..15],ADDR-REG-ID0,ADDR-REG-ID1,ADDR-REG-ID2,ADDR-REG-ID3,ALU[0..3],-ALU-FUNC,BR-COND,-BUS-EN,DATA[0..15],-HL-SWAP,IN,-INT,-INTA,IO-ADDR[0..3],-IO-ADDR-LD,-IO-RD,-IO-WR,-MEM-RD,-MEM-WR,OUT,-REG-DN,-REG-FUNC-LD,-REG-FUNC-RD,-REG-LD-HI,REG-LD-ID[0..3],-REG-LD-LO,-REG-RD-HI,REG-RD-ID[0..3],-REG-RD-LO,-REG-UP,-RESET,-RUN,-SR-LD,-TMP-REG-LD[0..1],-TMP-REG-RD[0..1],-VMA

## Sheet 9 of 9
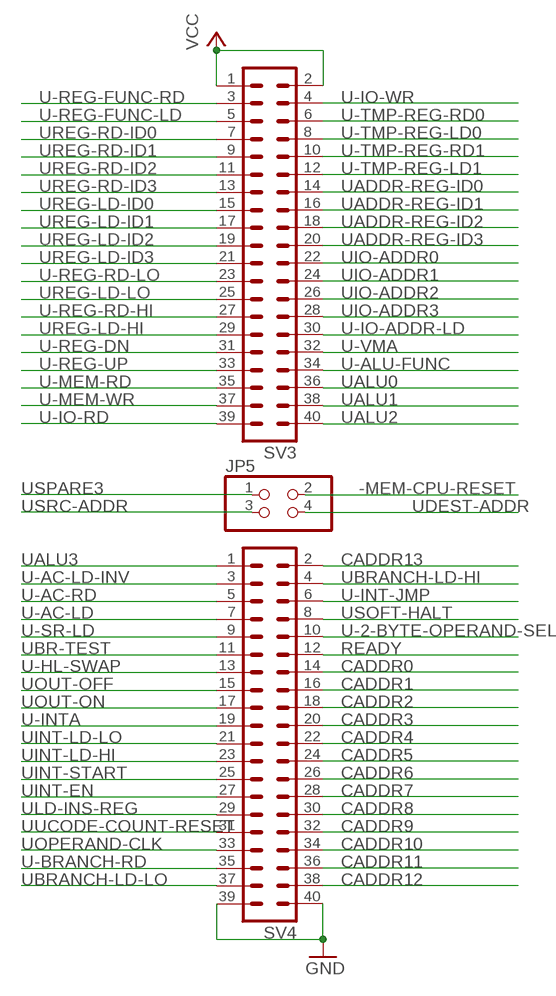
[diagram p8: schematic, sheet 9]

### Parts
JP5  PINHD-2X2  [2X02]
SV3  MA20-2  [MA20-2]
SV4  MA20-2  [MA20-2]

### Nets
-MEM-CPU-RESET: JP5.2 ; also sheet 2
CADDR0: SV4.14 ; also sheet 1
CADDR1: SV4.16 ; also sheet 1
CADDR2: SV4.18 ; also sheet 1
CADDR3: SV4.20 ; also sheet 1
CADDR4: SV4.22 ; also sheet 1
CADDR5: SV4.24 ; also sheet 1
CADDR6: SV4.26 ; also sheet 1
CADDR7: SV4.28 ; also sheet 1
CADDR8: SV4.30 ; also sheet 1
CADDR9: SV4.32 ; also sheet 1
CADDR10: SV4.34 ; also sheet 1
CADDR11: SV4.36 ; also sheet 1
CADDR12: SV4.38 ; also sheet 1
CADDR13: SV4.2 ; also sheet 1
GND: SV4.39 SV4.40 ; also sheet 1,3,5,6,7,8
READY: SV4.12 ; also sheet 1
U-2-BYTE-OPERAND-SEL: SV4.10 ; also sheet 2
U-AC-LD: SV4.7 ; also sheet 2
U-AC-LD-INV: SV4.3 ; also sheet 2
U-AC-RD: SV4.5 ; also sheet 2
U-ALU-FUNC: SV3.34 ; also sheet 2
U-BRANCH-RD: SV4.35 ; also sheet 2
U-HL-SWAP: SV4.13 ; also sheet 2
U-INT-JMP: SV4.6 ; also sheet 2
U-INTA: SV4.19 ; also sheet 2
U-IO-ADDR-LD: SV3.30 ; also sheet 2
U-IO-RD: SV3.39 ; also sheet 2
U-IO-WR: SV3.4 ; also sheet 2
U-MEM-RD: SV3.35 ; also sheet 2
U-MEM-WR: SV3.37 ; also sheet 2
U-REG-DN: SV3.31 ; also sheet 2
U-REG-FUNC-LD: SV3.5 ; also sheet 2
U-REG-FUNC-RD: SV3.3 ; also sheet 2
U-REG-RD-HI: SV3.27 ; also sheet 2
U-REG-RD-LO: SV3.23 ; also sheet 2
U-REG-UP: SV3.33 ; also sheet 2
U-SR-LD: SV4.9 ; also sheet 2
U-TMP-REG-LD0: SV3.8 ; also sheet 2
U-TMP-REG-LD1: SV3.12 ; also sheet 2
U-TMP-REG-RD0: SV3.6 ; also sheet 2
U-TMP-REG-RD1: SV3.10 ; also sheet 2
U-VMA: SV3.32 ; also sheet 2
UADDR-REG-ID0: SV3.14 ; also sheet 2
UADDR-REG-ID1: SV3.16 ; also sheet 2
UADDR-REG-ID2: SV3.18 ; also sheet 2
UADDR-REG-ID3: SV3.20 ; also sheet 2
UALU0: SV3.36 ; also sheet 2
UALU1: SV3.38 ; also sheet 2
UALU2: SV3.40 ; also sheet 2
UALU3: SV4.1 ; also sheet 2
UBR-TEST: SV4.11 ; also sheet 2
UBRANCH-LD-HI: SV4.4 ; also sheet 2
UBRANCH-LD-LO: SV4.37 ; also sheet 2
UDEST-ADDR: JP5.4 ; also sheet 2
UINT-EN: SV4.27 ; also sheet 2
UINT-LD-HI: SV4.23 ; also sheet 2
UINT-LD-LO: SV4.21 ; also sheet 2
UINT-START: SV4.25 ; also sheet 2
UIO-ADDR0: SV3.22 ; also sheet 2
UIO-ADDR1: SV3.24 ; also sheet 2
UIO-ADDR2: SV3.26 ; also sheet 2
UIO-ADDR3: SV3.28 ; also sheet 2
ULD-INS-REG: SV4.29 ; also sheet 2
UOPERAND-CLK: SV4.33 ; also sheet 2
UOUT-OFF: SV4.15 ; also sheet 2
UOUT-ON: SV4.17 ; also sheet 2
UREG-LD-HI: SV3.29 ; also sheet 2
UREG-LD-ID0: SV3.15 ; also sheet 2
UREG-LD-ID1: SV3.17 ; also sheet 2
UREG-LD-ID2: SV3.19 ; also sheet 2
UREG-LD-ID3: SV3.21 ; also sheet 2
UREG-LD-LO: SV3.25 ; also sheet 2
UREG-RD-ID0: SV3.7 ; also sheet 2
UREG-RD-ID1: SV3.9 ; also sheet 2
UREG-RD-ID2: SV3.11 ; also sheet 2
UREG-RD-ID3: SV3.13 ; also sheet 2
USOFT-HALT: SV4.8 ; also sheet 2
USPARE3: JP5.1 ; also sheet 2
USRC-ADDR: JP5.3 ; also sheet 2
UUCODE-COUNT-RESET: SV4.31 ; also sheet 2
VCC: SV3.1 SV3.2 ; also sheet 1,3,5,7

## Power pins joined to a net without a drawn wire
GND: IC1.10(P:GND) IC2.10(P:GND) IC3.8(GND) IC4.8(GND) IC5.8(GND) IC6.8(GND) IC7.7(P:GND) IC8.10(P:GND) IC9.10(P:GND) IC10.7(P:GND) IC11.7(P:GND) IC12.7(P:GND) IC13.10(GND) IC14.10(GND) IC15.10(GND) IC16.10(GND) IC17.10(GND) IC18.10(GND) IC19.10(GND) IC20.10(GND) IC21.7(P:GND) IC22.7(P:GND) IC23.7(P:GND) IC24.7(P:GND) IC25.10(GND) IC26.10(GND) IC27.10(GND) IC28.10(GND) IC29.7(P:GND) IC30.7(P:GND) IC31.7(P:GND) IC32.10(P:GND) IC33.10(P:GND) IC34.10(GND) IC35.7(P:GND) IC36.7(P:GND) IC37.10(P:GND) IC39.10(P:GND) QG1.7(GND)
VCC: IC1.20(P:VCC) IC2.20(P:VCC) IC3.16(VCC) IC4.16(VCC) IC5.16(VCC) IC6.16(VCC) IC7.14(P:VCC) IC8.20(P:VCC) IC9.20(P:VCC) IC10.14(P:VCC) IC11.14(P:VCC) IC12.14(P:VCC) IC13.20(VCC) IC14.20(VCC) IC15.20(VCC) IC16.20(VCC) IC17.20(VCC) IC18.20(VCC) IC19.20(VCC) IC20.20(VCC) IC21.14(P:VCC) IC22.14(P:VCC) IC23.14(P:VCC) IC24.14(P:VCC) IC25.20(VCC) IC26.20(VCC) IC27.20(VCC) IC28.20(VCC) IC29.14(P:VCC) IC30.14(P:VCC) IC31.14(P:VCC) IC32.20(P:VCC) IC33.20(P:VCC) IC34.20(VCC) IC35.14(P:VCC) IC36.14(P:VCC) IC37.20(P:VCC) IC39.20(P:VCC) QG1.14(VCC)

## Library data of the parts
-INT-PULLUP = pinhead:PINHD-1X2: PIN HEADER
. = led:LED: LED OSRAM: - CHIPLED LG R971, LG N971, LY N971, LG Q971, LY Q971, LO R971, LY R971 LH N974, LH R974 LS Q976, LO Q976, LY Q976 LO Q996 - Hyper CHIPLED LW Q18S LB Q993, LB Q99A, LB R99A - SideLED LS A670, LO A670, LY A670, LG A670, LP A670 LB A673, LV A673, LT A673, LW A673 LH A674 LY A675 LS A676, LA A676, LO A676, LY A676, LW A676 LS A679, LY A679, LG A679 - Hyper Micro SIDELED® LS Y876, LA Y876, LO Y876, LY Y876 LT Y87S - SmartLED LW L88C, LW L88S LB L89C, LB L89S, LG L890 LS L89K, LO L89K, LY L89K LS L896, LA L896, LO L896, LY L896 - TOPLED LS T670, LO T670, LY T670, LG T670, LP T670 LSG T670, LSP T670, LSY T670, LOP T670, LYG T670 LG T671, LOG T671, LSG T671 LB T673, LV T673, LT T673, LW T673 LH T674 LS T676, LA T676, LO T676, LY T676, LB T676, LH T676, LSB T676, LW T676 LB T67C, LV T67C, LT T67C, LS T67K, LO T67K, LY T67K, LW E67C LS E67B, LA E67B, LO E67B, LY E67B, LB E67C, LV E67C, LT E67C LW T67C LS T679, LY T679, LG T679 LS T770, LO T770, LY T770, LG T770, LP T770 LB T773, LV T773, LT T773, LW T773 LH T774 LS E675, LA E675, LY E675, LS T675 LS T776, LA T776, LO T776, LY T776, LB T776 LHGB T686 LT T68C, LB T68C - Hyper Mini TOPLED® LB M676 - Mini TOPLED Santana® LG M470 LS M47K, LO M47K, LY M47K Source: http://www.osram.convergy.de LUXEON: - LUMILED® LXK2-PW12-R00, LXK2-PW12-S00, LXK2-PW14-U00, LXK2-PW14-V00 LXK2-PM12-R00, LXK2-PM12-S00, LXK2-PM14-U00 LXK2-PE12-Q00, LXK2-PE12-R00, LXK2-PE12-S00, LXK2-PE14-T00, LXK2-PE14-U00 LXK2-PB12-K00, LXK2-PB12-L00, LXK2-PB12-M00, LXK2-PB14-N00, LXK2-PB14-P00, LXK2-PB14-Q00 LXK2-PR12-L00, LXK2-PR12-M00, LXK2-PR14-Q00, LXK2-PR14-R00 LXK2-PD12-Q00, LXK2-PD12-R00, LXK2-PD12-S00 LXK2-PH12-R00, LXK2-PH12-S00 LXK2-PL12-P00, LXK2-PL12-Q00, LXK2-PL12-R00 Source: www.luxeon.com KINGBRIGHT: KA-3528ASYC Source: www.kingbright.com
C1-C36 = SparkFun-Capacitors:CAP: Capacitor Standard 0603 ceramic capacitor, and 0.1" leaded capacitor.
CONT HALT = SparkFun-Electromechanical:SWITCH-MOMENTARY-2: Various NO switches- pushbuttons, reed, etc
EXT-SS-CLK SS-SEL = pinhead:PINHD-1X3: PIN HEADER
IC1 IC2 IC8 IC9 IC32 IC33 IC37 IC39 = 74xx-us:74*244: Octal BUFFER and LINE DRIVER, 3-state
IC3 IC4 = 74xx-us:74*175: Qadruple D type FLIP FLOP, clear
IC5 IC6 = 74xx-us:74*192: Synchronous 4-bit UP/DOWN COUNTER
IC7 IC12 IC29 = 74xx-us:74*08: Quad 2-input AND gate
IC10 IC24 IC35 = 74xx-us:74*32: Quad 2-input OR gate
IC11 IC30 IC36 = 74xx-us:74*04: Hex INVERTER
IC13-IC20 IC25-IC28 IC34 = 74xx-us:74*374: Octal D type transparent LATCH, edge triggered
IC21 IC23 IC31 = 74xx-us:74*02: Quad 2-input NOR gate
IC22 = 74xx-us:74*74: Dual D type positive edge triggered FLIP FLOP, preset and clear
JP1 = pinhead:PINHD-1X5: PIN HEADER
JP2 = Connector:PINHD-1X2: PIN HEADER; CATEGORY: CONNECTOR; SUB-CATEGORY: PIN-HEADER
JP5 = pinhead:PINHD-2X2: PIN HEADER
QG1 = crystal:XO-: CRYSTAL; OC_FARNELL: unknown; OC_NEWARK: unknown
R2-R9 R16 = adafruit:R-US_: RESISTOR, American symbol
R10 = eagle-ltspice:R: RESISTOR, European symbol; SPICEMODEL: NONE; SPICEPREFIX: R
RESET SS/WAIT STEP-CLK = switch:9070-1W: TOGGLE SWITCH Marquardt
SV3 SV4 = con-lstb:MA20-2: PIN HEADER; OC_FARNELL: unknown; OC_NEWARK: unknown
X3 = con-vg:FABC96R: CONNECTOR female, 96 pins, type R, rows ABC, grid 2.54 mm

## Board
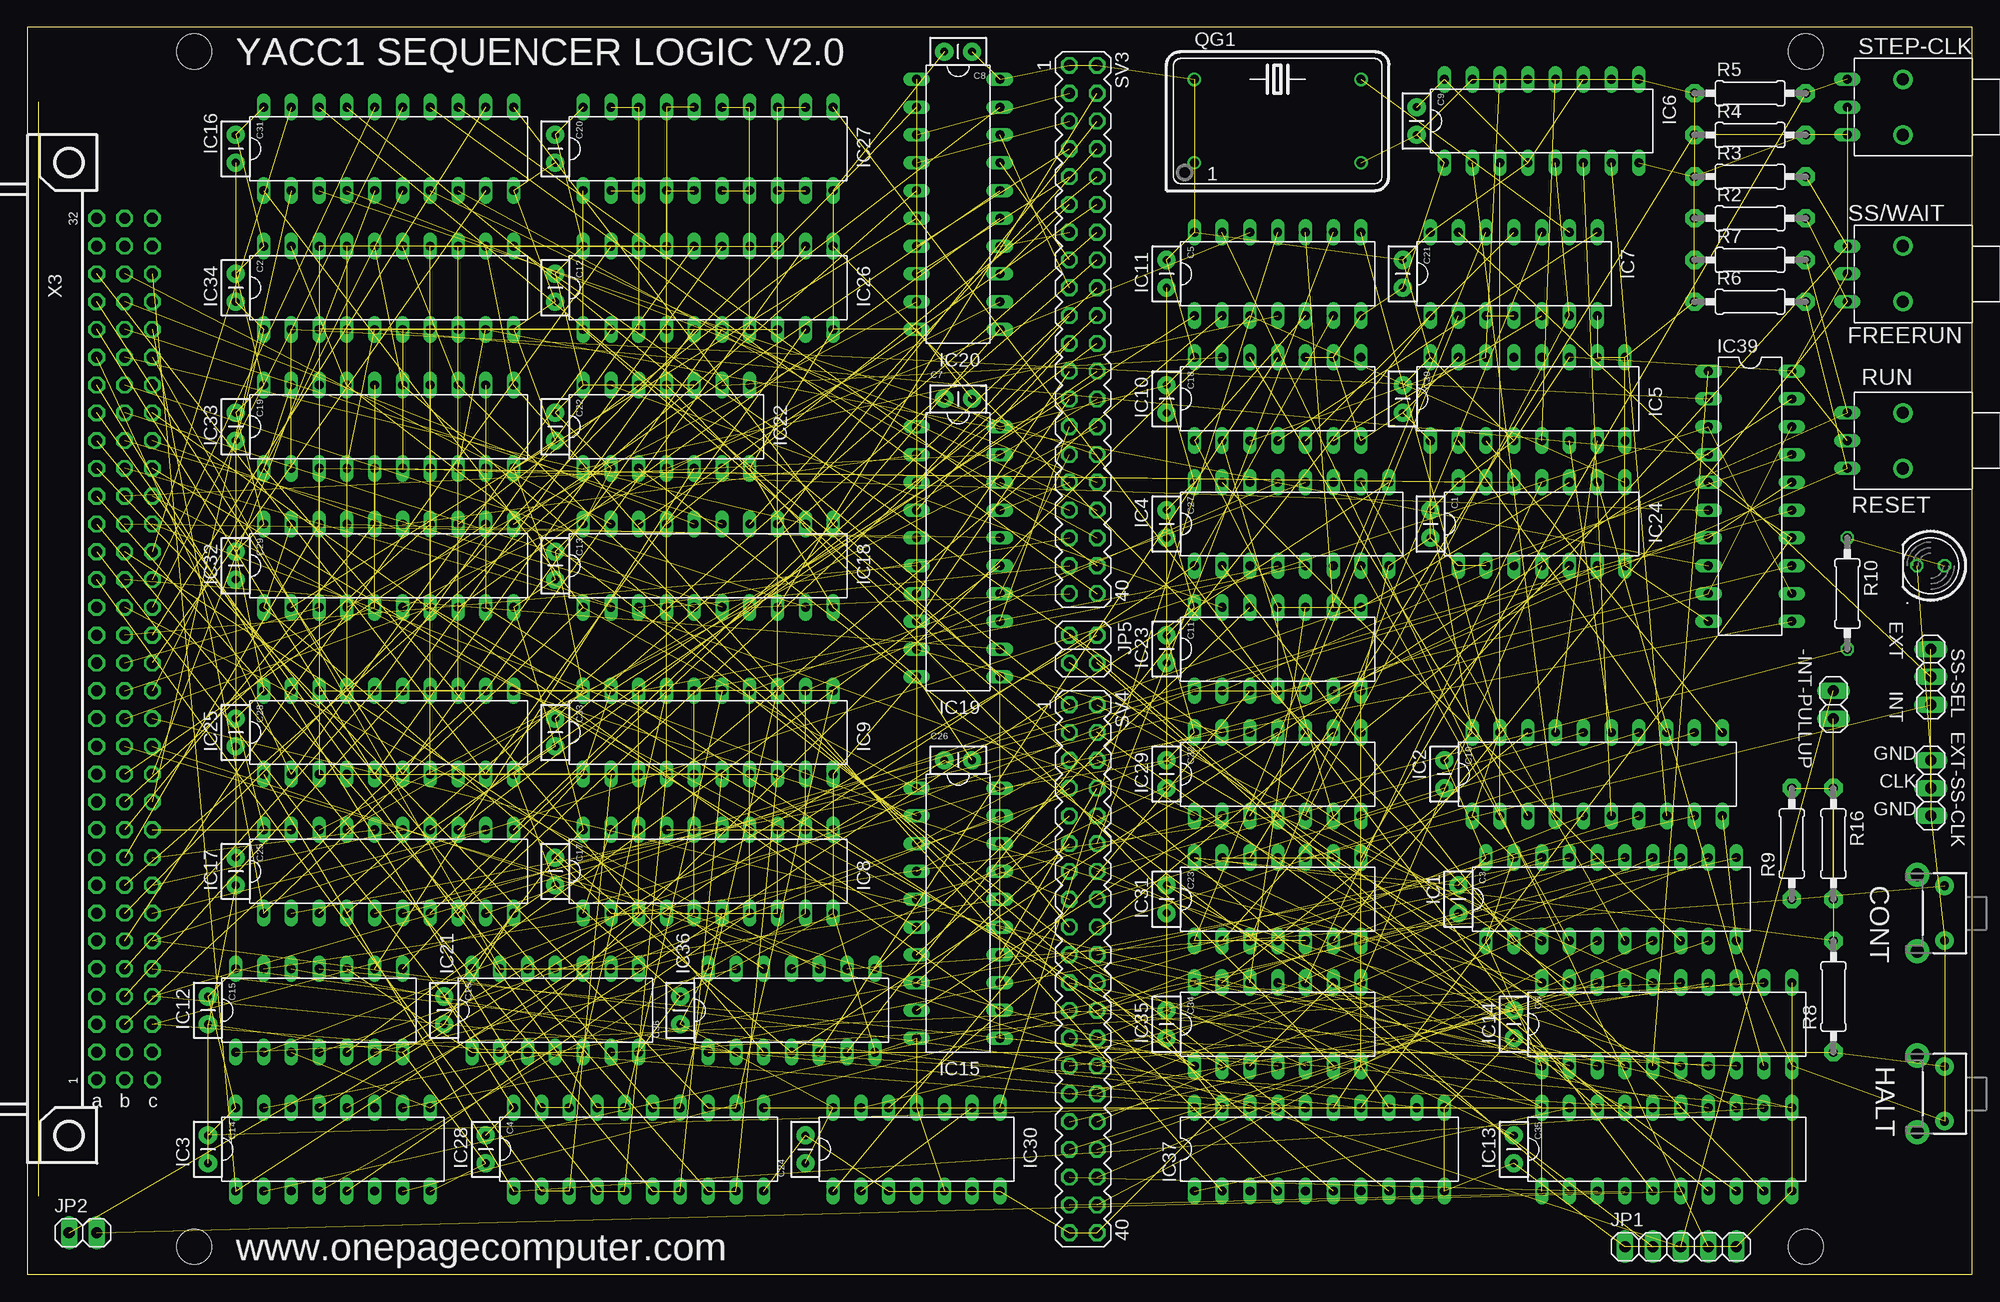
[diagram p9: board, top side]
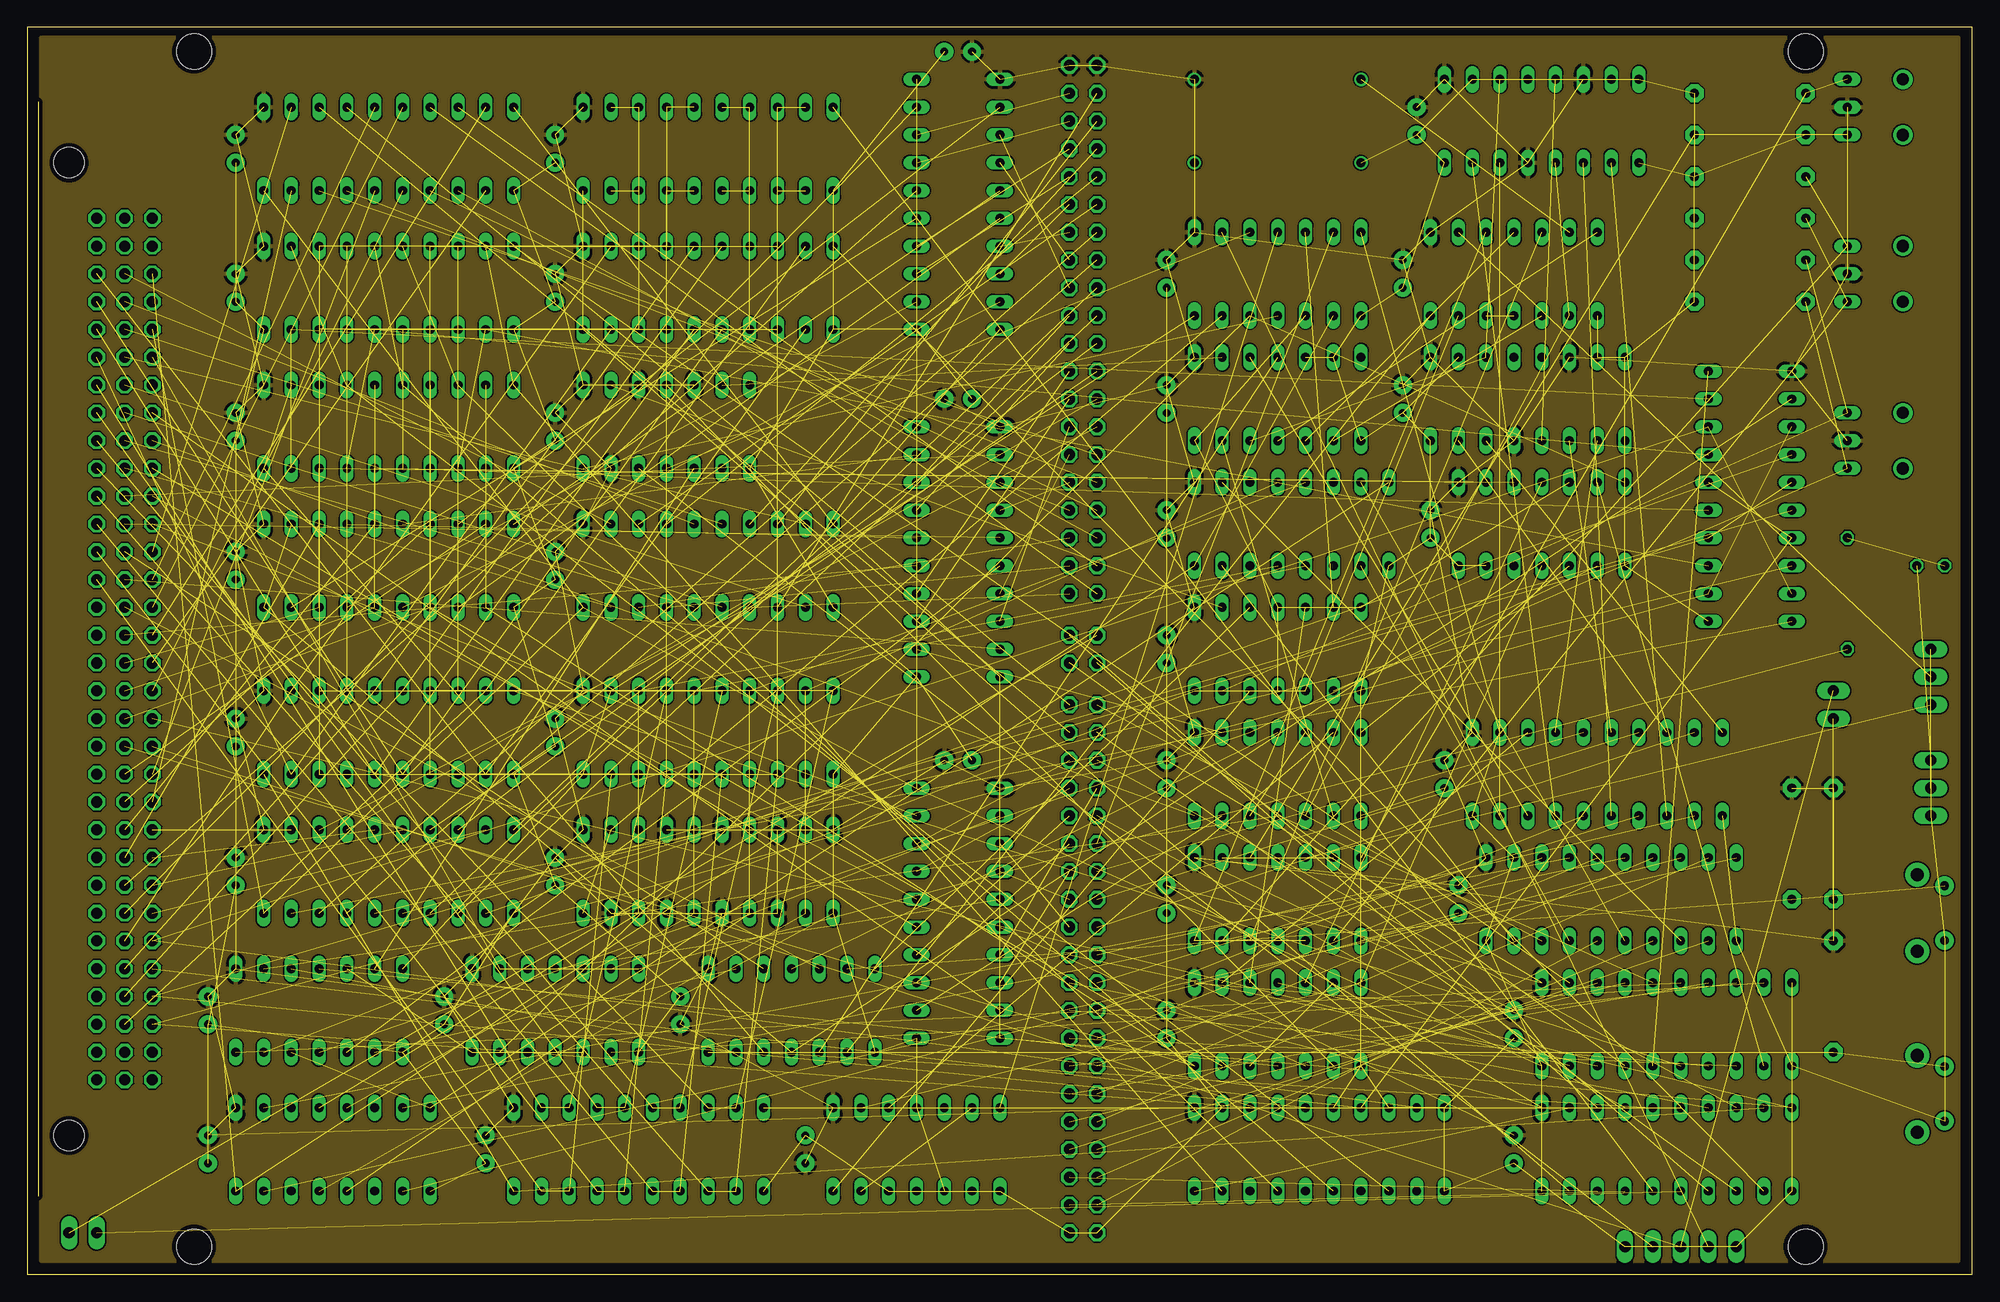
[diagram p10: board, inner layer Route2]
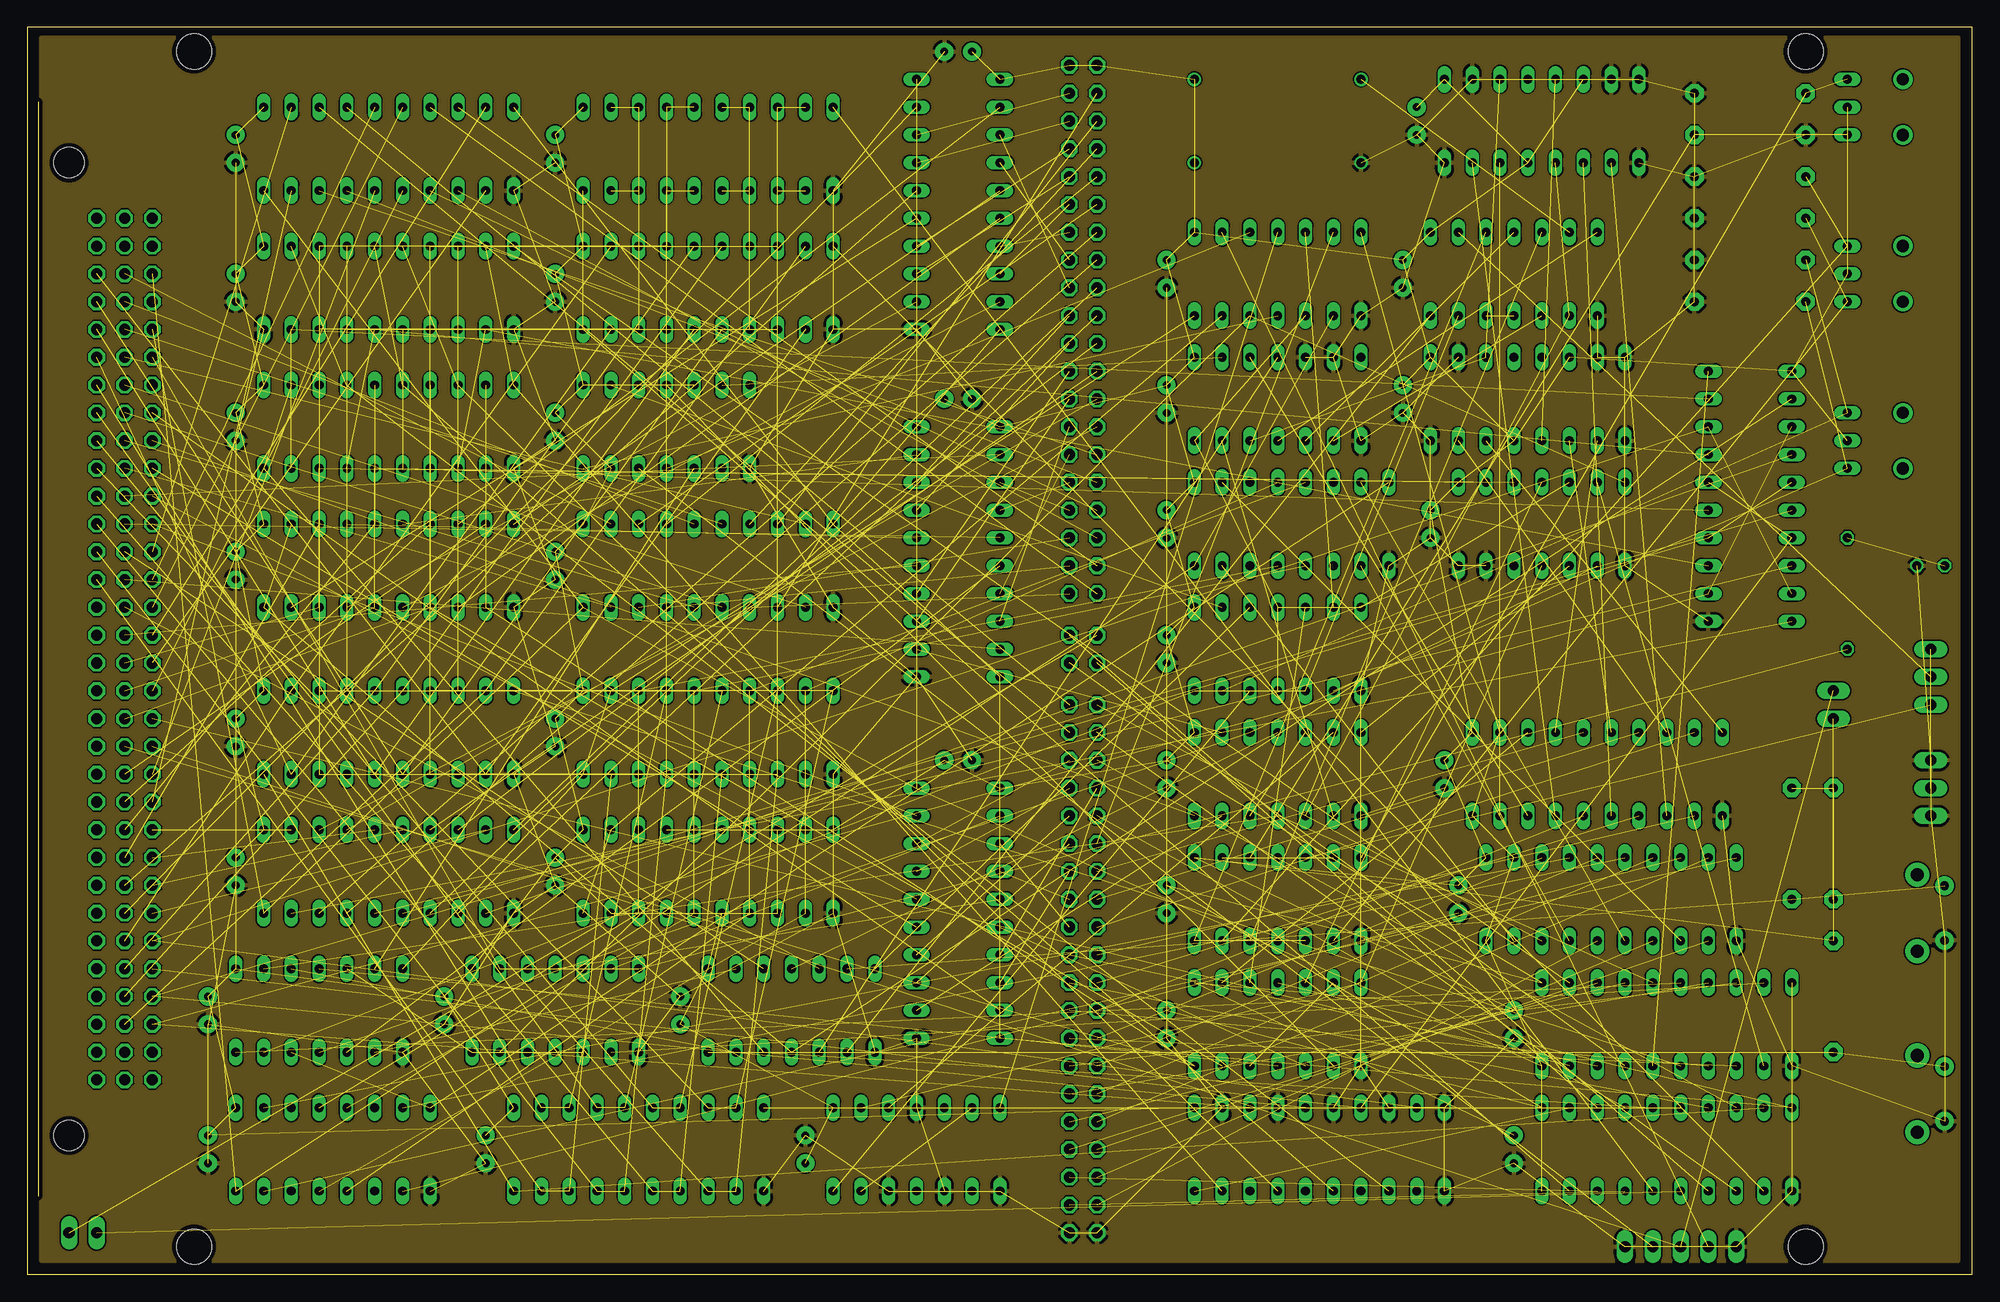
[diagram p11: board, inner layer Route15]

Size 177.78 x 113.97 mm. Coordinates in mm from the lower left corner, seen from the top.
Outline: 0,0 177.78,0 177.78,113.97 0,113.97 0,0
Copper layers (1*2*15*16): Top 0.035559375mm / dielectric 0.17018125mm / Route2 0.01778125mm / dielectric 47mil / Route15 0.01778125mm / dielectric 0.17018125mm / Bottom 0.035559375mm
Design rules "oshpark-4layer": minimum track width 5mil, minimum drill 10mil, track to track 5mil, track to pad 5mil, pad to pad 5mil, via to via 5mil, smd to smd 5mil, copper to edge 15mil, drill to drill 6mil, minimum pad ring 4mil, minimum via ring 4mil, stop-mask expansion 2.5mil, vias tented up to drill 0mil, thermal gap 10mil
Holes 3.2 mm at 15.24,111.76 15.24,2.54 162.56,2.54 162.56,111.76

### Footprints (pad centres in the part's own frame; a part is rotated, then mirrored left to right if it is on the bottom)
1X02 = drill 1.016 long: 1 -1.27,0; 2 1.27,0
LED5MM = drill 0.813 octagon: A -1.27,0; K 1.27,0
CAP-PTH-SMALLEZ = drill 0.7 pad 1.651: 1 0,0; 2 2.54,0
TACTILE-PTH-SIDEEZ = drill 0.8 pad 1.7: 1 -2.5,0; 2 2.5,0 | drill 1.2 pad 2.2: ANCHOR1 -3.5,2.5; ANCHOR2 3.5,2.5
1X03 = drill 1.016 long: 1 -2.54,0; 2 0,0; 3 2.54,0
DIL20 = drill 0.813 long: 1 -11.43,-3.81; 2 -8.89,-3.81; 3 -6.35,-3.81; 4 -3.81,-3.81; 5 -1.27,-3.81; 6 1.27,-3.81; 7 3.81,-3.81; 8 6.35,-3.81; 9 8.89,-3.81; 10 11.43,-3.81; 11 11.43,3.81; 12 8.89,3.81; 13 6.35,3.81; 14 3.81,3.81; 15 1.27,3.81; 16 -1.27,3.81; 17 -3.81,3.81; 18 -6.35,3.81; 19 -8.89,3.81; 20 -11.43,3.81
DIL16 = drill 0.813 long: 1 -8.89,-3.81; 2 -6.35,-3.81; 3 -3.81,-3.81; 4 -1.27,-3.81; 5 1.27,-3.81; 6 3.81,-3.81; 7 6.35,-3.81; 8 8.89,-3.81; 9 8.89,3.81; 10 6.35,3.81; 11 3.81,3.81; 12 1.27,3.81; 13 -1.27,3.81; 14 -3.81,3.81; 15 -6.35,3.81; 16 -8.89,3.81
DIL14 = drill 0.813 long: 1 -7.62,-3.81; 2 -5.08,-3.81; 3 -2.54,-3.81; 4 0,-3.81; 5 2.54,-3.81; 6 5.08,-3.81; 7 7.62,-3.81; 8 7.62,3.81; 9 5.08,3.81; 10 2.54,3.81; 11 0,3.81; 12 -2.54,3.81; 13 -5.08,3.81; 14 -7.62,3.81
1X05 = drill 1.016 long: 1 -5.08,0; 2 -2.54,0; 3 0,0; 4 2.54,0; 5 5.08,0
2X02 = drill 1.016 octagon: 1 -1.27,-1.27; 2 -1.27,1.27; 3 1.27,-1.27; 4 1.27,1.27
DIL14S = drill 0.813: 1 -7.62,-3.81; 7 7.62,-3.81; 8 7.62,3.81; 14 -7.62,3.81
0207/10 = drill 0.813 pad 1.676 octagon: 1 -5.08,0; 2 5.08,0
0207/10' = drill 0.813 octagon: 1 -5.08,0; 2 5.08,0
9070-1W = drill 0.813 long: 1 5.08,-2.54; 2 5.08,0; 3 5.08,2.54 | drill 1.118 pad 1.778: B 0,-2.54; B1 0,2.54
MA20-2 = drill 1.016 octagon: 1 -24.13,-1.27; 2 -24.13,1.27; 3 -21.59,-1.27; 4 -21.59,1.27; 5 -19.05,-1.27; 6 -19.05,1.27; 7 -16.51,-1.27; 8 -16.51,1.27; 9 -13.97,-1.27; 10 -13.97,1.27; 11 -11.43,-1.27; 12 -11.43,1.27; 13 -8.89,-1.27; 14 -8.89,1.27; 15 -6.35,-1.27; 16 -6.35,1.27; 17 -3.81,-1.27; 18 -3.81,1.27; 19 -1.27,-1.27; 20 -1.27,1.27; 21 1.27,-1.27; 22 1.27,1.27; 23 3.81,-1.27; 24 3.81,1.27; 25 6.35,-1.27; 26 6.35,1.27; 27 8.89,-1.27; 28 8.89,1.27; 29 11.43,-1.27; 30 11.43,1.27; 31 13.97,-1.27; 32 13.97,1.27; 33 16.51,-1.27; 34 16.51,1.27; 35 19.05,-1.27; 36 19.05,1.27; 37 21.59,-1.27; 38 21.59,1.27; 39 24.13,-1.27; 40 24.13,1.27
FABC96R = drill 1.016 octagon: A1 -2.54,39.37; A2 -2.54,36.83; A3 -2.54,34.29; A4 -2.54,31.75; A5 -2.54,29.21; A6 -2.54,26.67; A7 -2.54,24.13; A8 -2.54,21.59; A9 -2.54,19.05; A10 -2.54,16.51; A11 -2.54,13.97; A12 -2.54,11.43; A13 -2.54,8.89; A14 -2.54,6.35; A15 -2.54,3.81; A16 -2.54,1.27; A17 -2.54,-1.27; A18 -2.54,-3.81; A19 -2.54,-6.35; A20 -2.54,-8.89; A21 -2.54,-11.43; A22 -2.54,-13.97; A23 -2.54,-16.51; A24 -2.54,-19.05; A25 -2.54,-21.59; A26 -2.54,-24.13; A27 -2.54,-26.67; A28 -2.54,-29.21; A29 -2.54,-31.75; A30 -2.54,-34.29; A31 -2.54,-36.83; A32 -2.54,-39.37; B1 -5.08,39.37; B2 -5.08,36.83; B3 -5.08,34.29; B4 -5.08,31.75; B5 -5.08,29.21; B6 -5.08,26.67; B7 -5.08,24.13; B8 -5.08,21.59; B9 -5.08,19.05; B10 -5.08,16.51; B11 -5.08,13.97; B12 -5.08,11.43; B13 -5.08,8.89; B14 -5.08,6.35; B15 -5.08,3.81; B16 -5.08,1.27; B17 -5.08,-1.27; B18 -5.08,-3.81; B19 -5.08,-6.35; B20 -5.08,-8.89; B21 -5.08,-11.43; B22 -5.08,-13.97; B23 -5.08,-16.51; B24 -5.08,-19.05; B25 -5.08,-21.59; B26 -5.08,-24.13; B27 -5.08,-26.67; B28 -5.08,-29.21; B29 -5.08,-31.75; B30 -5.08,-34.29; B31 -5.08,-36.83; B32 -5.08,-39.37; C1 -7.62,39.37; C2 -7.62,36.83; C3 -7.62,34.29; C4 -7.62,31.75; C5 -7.62,29.21; C6 -7.62,26.67; C7 -7.62,24.13; C8 -7.62,21.59; C9 -7.62,19.05; C10 -7.62,16.51; C11 -7.62,13.97; C12 -7.62,11.43; C13 -7.62,8.89; C14 -7.62,6.35; C15 -7.62,3.81; C16 -7.62,1.27; C17 -7.62,-1.27; C18 -7.62,-3.81; C19 -7.62,-6.35; C20 -7.62,-8.89; C21 -7.62,-11.43; C22 -7.62,-13.97; C23 -7.62,-16.51; C24 -7.62,-19.05; C25 -7.62,-21.59; C26 -7.62,-24.13; C27 -7.62,-26.67; C28 -7.62,-29.21; C29 -7.62,-31.75; C30 -7.62,-34.29; C31 -7.62,-36.83; C32 -7.62,-39.37 | hole 2.794: 0,-44.456; 0,44.456

### Placement (x,y rotation side)
-INT-PULLUP  165.1,52.07 90 top
.  173.99,64.77 180 top
C1  128.27,69.85 270 top
C2  19.05,91.44 270 top
C3  130.81,35.56 270 top
C4  41.91,12.7 270 top
C5  104.14,92.71 270 top
C6  135.89,24.13 270 top
C7  83.82,80.01 0 top
C8  86.36,111.76 180 top
C9  127,106.68 270 top
C10  129.54,46.99 270 top
C11  104.14,58.42 270 top
C12  48.26,91.44 270 top
C13  48.26,66.04 270 top
C14  16.51,12.7 270 top
C15  16.51,25.4 270 top
C16  38.1,25.4 270 top
C17  48.26,38.1 270 top
C18  104.14,81.28 270 top
C19  19.05,78.74 270 top
C20  48.26,104.14 270 top
C21  125.73,92.71 270 top
C22  48.26,78.74 270 top
C23  104.14,35.56 270 top
C24  71.12,10.16 90 top
C25  19.05,38.1 270 top
C26  83.82,46.99 0 top
C27  104.14,69.85 270 top
C28  19.05,50.8 270 top
C29  19.05,66.04 270 top
C30  125.73,81.28 270 top
C31  19.05,104.14 270 top
C32  104.14,46.99 270 top
C33  48.26,50.8 270 top
C34  104.14,24.13 270 top
C35  135.89,12.7 270 top
C36  59.69,22.86 90 top
CONT  175.26,33.02 90 top
EXT-SS-CLK  173.99,44.45 270 top
HALT  175.26,16.51 90 top
IC1  144.78,34.29 0 top
IC2  143.51,45.72 0 top
IC3  27.94,11.43 0 top
IC4  115.57,68.58 0 top
IC5  137.16,80.01 0 top
IC6  138.43,105.41 0 top
IC7  135.89,91.44 0 top
IC8  62.23,36.83 0 top
IC9  62.23,49.53 0 top
IC10  114.3,80.01 0 top
IC11  114.3,91.44 0 top
IC12  26.67,24.13 0 top
IC13  149.86,11.43 0 top
IC14  149.86,22.86 0 top
IC15  85.09,33.02 270 top
IC16  33.02,102.87 0 top
IC17  33.02,36.83 0 top
IC18  62.23,64.77 0 top
IC19  85.09,66.04 270 top
IC20  85.09,97.79 270 top
IC21  48.26,24.13 0 top
IC22  58.42,77.47 0 top
IC23  114.3,57.15 0 top
IC24  138.43,68.58 0 top
IC25  33.02,49.53 0 top
IC26  62.23,90.17 0 top
IC27  62.23,102.87 0 top
IC28  55.88,11.43 0 top
IC29  114.3,45.72 0 top
IC30  81.28,11.43 0 top
IC31  114.3,34.29 0 top
IC32  33.02,64.77 0 top
IC33  33.02,77.47 0 top
IC34  33.02,90.17 0 top
IC35  114.3,22.86 0 top
IC36  69.85,24.13 0 top
IC37  118.11,11.43 0 top
IC39  157.48,71.12 270 top
JP1  151.13,2.54 0 top
JP2  5.08,3.81 0 top
JP5  96.52,57.15 270 top
QG1  114.3,105.41 0 top
R2  157.48,96.52 180 top
R3  157.48,100.33 0 top
R4  157.48,104.14 0 top
R5  157.48,107.95 0 top
R6  157.48,88.9 180 top
R7  157.48,92.71 0 top
R8  165.1,25.4 90 top
R9  161.29,39.37 90 top
R10  330  [0207/10']  166.37,62.23 270 top
R16  165.1,39.37 270 top
RESET  171.45,76.2 180 top
SS-SEL  173.99,54.61 90 top
SS/WAIT  171.45,91.44 180 top
STEP-CLK  171.45,106.68 180 top
SV3  96.52,86.36 270 top
SV4  96.52,27.94 270 top
X3  3.81,57.15 180 top

### Tracks (layer width: path | path; a pad name or v marks a point on that pad's centre or on a via)
-2-BYTE-OPERAND-SEL  (3 unrouted)
-AC-LD  (1 unrouted)
-AC-LD-INV  (1 unrouted)
-AC-RD  (1 unrouted)
-ALU-FUNC  (1 unrouted)
-BRANCH-RD  (2 unrouted)
-BUS-EN  (13 unrouted)
-DO-INT  (2 unrouted)
-FP-HALT  (2 unrouted)
-HALT-CONT  (2 unrouted)
-HL-SWAP  (1 unrouted)
-INT  (2 unrouted)
-INT-JMP  (2 unrouted)
-INTA  (1 unrouted)
-IO-ADDR-LD  (1 unrouted)
-IO-RD  (1 unrouted)
-IO-WR  (1 unrouted)
-MEM-CPU-RESET  (1 unrouted)
-MEM-RD  (1 unrouted)
-MEM-WR  (1 unrouted)
-ONE-OPERAND-SEL  (3 unrouted)
-REG-DN  (1 unrouted)
-REG-FUNC-LD  (1 unrouted)
-REG-FUNC-RD  (1 unrouted)
-REG-LD-HI  (1 unrouted)
-REG-LD-LO  (1 unrouted)
-REG-RD-HI  (1 unrouted)
-REG-RD-LO  (1 unrouted)
-REG-UP  (1 unrouted)
-RESET  (3 unrouted)
-SR-LD  (1 unrouted)
-TMP-REG-LD0  (1 unrouted)
-TMP-REG-LD1  (1 unrouted)
-TMP-REG-RD0  (1 unrouted)
-TMP-REG-RD1  (1 unrouted)
-VMA  (1 unrouted)
ADDR-REG-ID0  (3 unrouted)
ADDR-REG-ID1  (3 unrouted)
ADDR-REG-ID2  (3 unrouted)
ADDR-REG-ID3  (3 unrouted)
ALU0  (1 unrouted)
ALU1  (1 unrouted)
ALU2  (1 unrouted)
ALU3  (1 unrouted)
BR-COND  (1 unrouted)
BR-TEST  (1 unrouted)
BRANCH-LD-HI  (1 unrouted)
BRANCH-LD-LO  (1 unrouted)
BUS-LATCH-CLK  (8 unrouted)
CADDR0  (1 unrouted)
CADDR1  (1 unrouted)
CADDR2  (1 unrouted)
CADDR3  (1 unrouted)
CADDR4  (1 unrouted)
CADDR5  (1 unrouted)
CADDR6  (1 unrouted)
CADDR7  (1 unrouted)
CADDR8  (1 unrouted)
CADDR9  (1 unrouted)
CADDR10  (1 unrouted)
CADDR11  (1 unrouted)
CADDR12  (1 unrouted)
CADDR13  (1 unrouted)
CNT-CLK  (1 unrouted)
COUNT-FAULT  (1 unrouted)
COUNT-RESET  (2 unrouted)
DATA0  (8 unrouted)
DATA1  (8 unrouted)
DATA2  (8 unrouted)
DATA3  (8 unrouted)
DATA4  (8 unrouted)
DATA5  (8 unrouted)
DATA6  (8 unrouted)
DATA7  (8 unrouted)
DATA8  (2 unrouted)
DATA9  (2 unrouted)
DATA10  (2 unrouted)
DATA11  (2 unrouted)
DATA12  (2 unrouted)
DATA13  (2 unrouted)
DATA14  (2 unrouted)
DATA15  (2 unrouted)
DEST-ADDR  (1 unrouted)
DO-HALT  (1 unrouted)
DO-INT  (3 unrouted)
EXTERNAL-SINGLESTEP-CLK  (1 unrouted)
FP-CLKH  (2 unrouted)
FP-CLKL  (2 unrouted)
FP-EXECUTE  (2 unrouted)
FP-FREERUN  (2 unrouted)
FP-HALT  (1 unrouted)
FP-HALT-CONT  (1 unrouted)
FP-RESET  (2 unrouted)
FP-SINGLE-STEP-CLK  (2 unrouted)
FP-SS  (2 unrouted)
FREE-RUN  (2 unrouted)
GND  (110 unrouted)
  pour Route15: 1.27,113.03 176.53,113.03 176.53,1.27 1.27,1.27
HALT-CLR  (1 unrouted)
HARD-RESET1  (1 unrouted)
INT-EDGE  (1 unrouted)
INT-EN  (1 unrouted)
INT-LD-HI  (1 unrouted)
INT-LD-LO  (1 unrouted)
INT-START  (1 unrouted)
IO-ADDR0  (1 unrouted)
IO-ADDR1  (1 unrouted)
IO-ADDR2  (1 unrouted)
IO-ADDR3  (1 unrouted)
LADDR-REG-ID0  (1 unrouted)
LADDR-REG-ID1  (1 unrouted)
LADDR-REG-ID2  (1 unrouted)
LADDR-REG-ID3  (1 unrouted)
LD-INS-REG  (1 unrouted)
LD-INS-REG1  (2 unrouted)
LREG-LD-HI  (1 unrouted)
LREG-LD-ID0  (1 unrouted)
LREG-LD-ID1  (1 unrouted)
LREG-LD-ID2  (1 unrouted)
LREG-LD-ID3  (1 unrouted)
LREG-LD-LO  (1 unrouted)
LREG-RD-ID0  (1 unrouted)
LREG-RD-ID1  (1 unrouted)
LREG-RD-ID2  (1 unrouted)
LREG-RD-ID3  (1 unrouted)
N$1  (1 unrouted)
N$2  (1 unrouted)
N$3  (1 unrouted)
N$4  (2 unrouted)
N$5  (2 unrouted)
N$6  (2 unrouted)
N$7  (1 unrouted)
N$8  (1 unrouted)
N$9  (1 unrouted)
N$10  (1 unrouted)
N$11  (1 unrouted)
N$12  (1 unrouted)
N$13  (1 unrouted)
N$14  (1 unrouted)
N$15  (1 unrouted)
N$16  (1 unrouted)
N$17  (2 unrouted)
N$18  (2 unrouted)
N$19  (2 unrouted)
N$20  (2 unrouted)
N$21  (2 unrouted)
N$22  (2 unrouted)
N$23  (1 unrouted)
N$24  (2 unrouted)
N$25  (1 unrouted)
N$26  (1 unrouted)
N$27  (2 unrouted)
N$28  (1 unrouted)
N$29  (1 unrouted)
N$31  (1 unrouted)
N$32  (1 unrouted)
N$33  (1 unrouted)
N$34  (1 unrouted)
N$35  (1 unrouted)
N$36  (1 unrouted)
N$37  (1 unrouted)
N$38  (1 unrouted)
N$39  (1 unrouted)
N$40  (1 unrouted)
N$41  (1 unrouted)
N$42  (1 unrouted)
N$43  (1 unrouted)
N$44  (1 unrouted)
N$45  (1 unrouted)
N$46  (1 unrouted)
N$47  (1 unrouted)
N$48  (1 unrouted)
N$49  (1 unrouted)
N$50  (1 unrouted)
N$51  (1 unrouted)
N$52  (1 unrouted)
N$53  (2 unrouted)
N$54  (1 unrouted)
N$55  (1 unrouted)
N$56  (2 unrouted)
N$57  (1 unrouted)
N$58  (1 unrouted)
N$59  (1 unrouted)
N$61  (2 unrouted)
N$62  (2 unrouted)
N$63  (2 unrouted)
N$64  (2 unrouted)
N$65  (2 unrouted)
N$66  (2 unrouted)
N$68  (2 unrouted)
N$69  (2 unrouted)
OPERAND-CLK  (1 unrouted)
OUT  (3 unrouted)
OUT-OFF  (1 unrouted)
OUT-ON  (1 unrouted)
READY  (1 unrouted)
REG-LD-ID0  (3 unrouted)
REG-LD-ID1  (3 unrouted)
REG-LD-ID2  (3 unrouted)
REG-LD-ID3  (3 unrouted)
REG-RD-ID0  (2 unrouted)
REG-RD-ID1  (2 unrouted)
REG-RD-ID2  (2 unrouted)
REG-RD-ID3  (2 unrouted)
RESET  (7 unrouted)
RUN  (3 unrouted)
SINGLE-STEP-CLK  (1 unrouted)
SINGLE-STEP/WAIT  (2 unrouted)
SOFT-HALT  (1 unrouted)
SPARE3  (1 unrouted)
SRC-ADDR  (1 unrouted)
U-2-BYTE-OPERAND-SEL  (1 unrouted)
U-AC-LD  (1 unrouted)
U-AC-LD-INV  (1 unrouted)
U-AC-RD  (1 unrouted)
U-ALU-FUNC  (1 unrouted)
U-BRANCH-RD  (1 unrouted)
U-HL-SWAP  (1 unrouted)
U-INT-JMP  (1 unrouted)
U-INTA  (1 unrouted)
U-IO-ADDR-LD  (1 unrouted)
U-IO-RD  (1 unrouted)
U-IO-WR  (1 unrouted)
U-MEM-RD  (1 unrouted)
U-MEM-WR  (1 unrouted)
U-REG-DN  (1 unrouted)
U-REG-FUNC-LD  (1 unrouted)
U-REG-FUNC-RD  (1 unrouted)
U-REG-RD-HI  (1 unrouted)
U-REG-RD-LO  (1 unrouted)
U-REG-UP  (1 unrouted)
U-SR-LD  (1 unrouted)
U-TMP-REG-LD0  (1 unrouted)
U-TMP-REG-LD1  (1 unrouted)
U-TMP-REG-RD0  (1 unrouted)
U-TMP-REG-RD1  (1 unrouted)
U-VMA  (1 unrouted)
UADDR-REG-ID0  (1 unrouted)
UADDR-REG-ID1  (1 unrouted)
UADDR-REG-ID2  (1 unrouted)
UADDR-REG-ID3  (1 unrouted)
UALU0  (1 unrouted)
UALU1  (1 unrouted)
UALU2  (1 unrouted)
UALU3  (1 unrouted)
UBR-TEST  (1 unrouted)
UBRANCH-LD-HI  (1 unrouted)
UBRANCH-LD-LO  (1 unrouted)
UCODE-CLK  (1 unrouted)
UCODE-COUNT-RESET  (2 unrouted)
UDEST-ADDR  (1 unrouted)
UINT-EN  (1 unrouted)
UINT-LD-HI  (1 unrouted)
UINT-LD-LO  (1 unrouted)
UINT-START  (1 unrouted)
UIO-ADDR0  (1 unrouted)
UIO-ADDR1  (1 unrouted)
UIO-ADDR2  (1 unrouted)
UIO-ADDR3  (1 unrouted)
ULD-INS-REG  (1 unrouted)
UOPERAND-CLK  (1 unrouted)
UOUT-OFF  (1 unrouted)
UOUT-ON  (1 unrouted)
UREG-LD-HI  (1 unrouted)
UREG-LD-ID0  (1 unrouted)
UREG-LD-ID1  (1 unrouted)
UREG-LD-ID2  (1 unrouted)
UREG-LD-ID3  (1 unrouted)
UREG-LD-LO  (1 unrouted)
UREG-RD-ID0  (1 unrouted)
UREG-RD-ID1  (1 unrouted)
UREG-RD-ID2  (1 unrouted)
UREG-RD-ID3  (1 unrouted)
USOFT-HALT  (1 unrouted)
USPARE3  (1 unrouted)
USRC-ADDR  (1 unrouted)
UUCODE-COUNT-RESET  (1 unrouted)
VCC  (97 unrouted)
  pour Route2: 1.27,113.03 176.53,113.03 176.53,1.27 1.27,1.27

### Text on the board
tNames: YACC1 SEQUENCER LOGIC V2.0 | FREERUN | RUN | EXT | INT | GND | CLK | GND | www.onepagecomputer.com